# Altium schematic sheet Sheet1.SchDoc
size A0
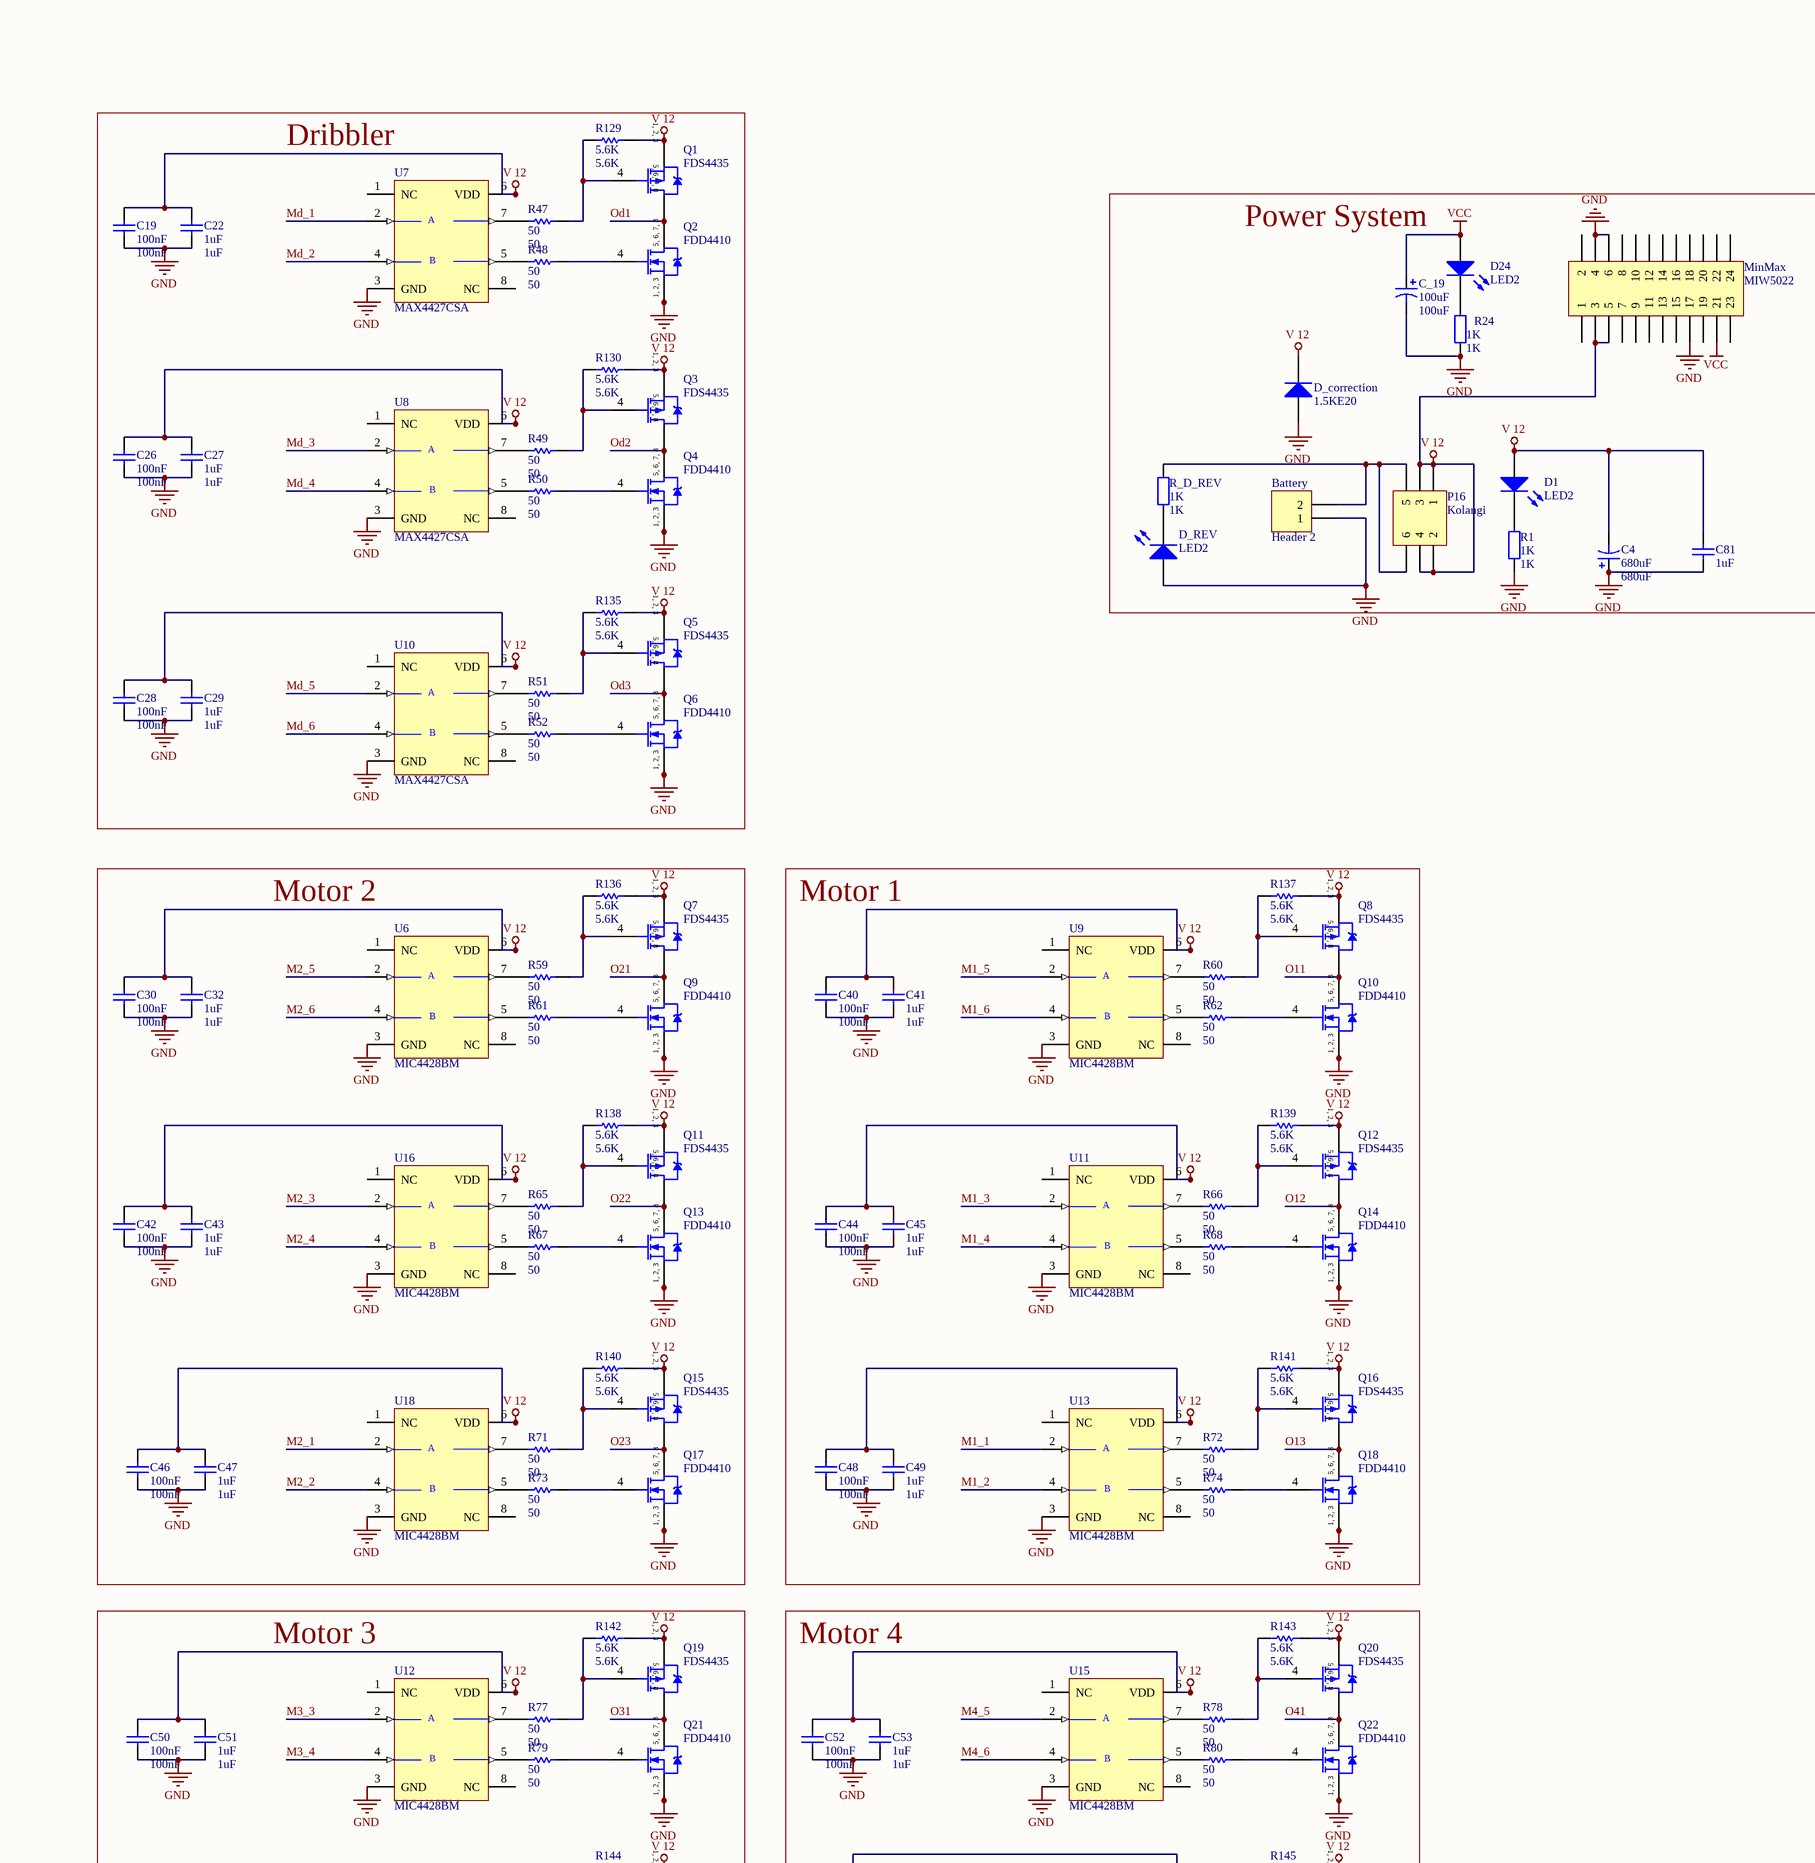
[diagram p0: Sheet1.SchDoc, top left]
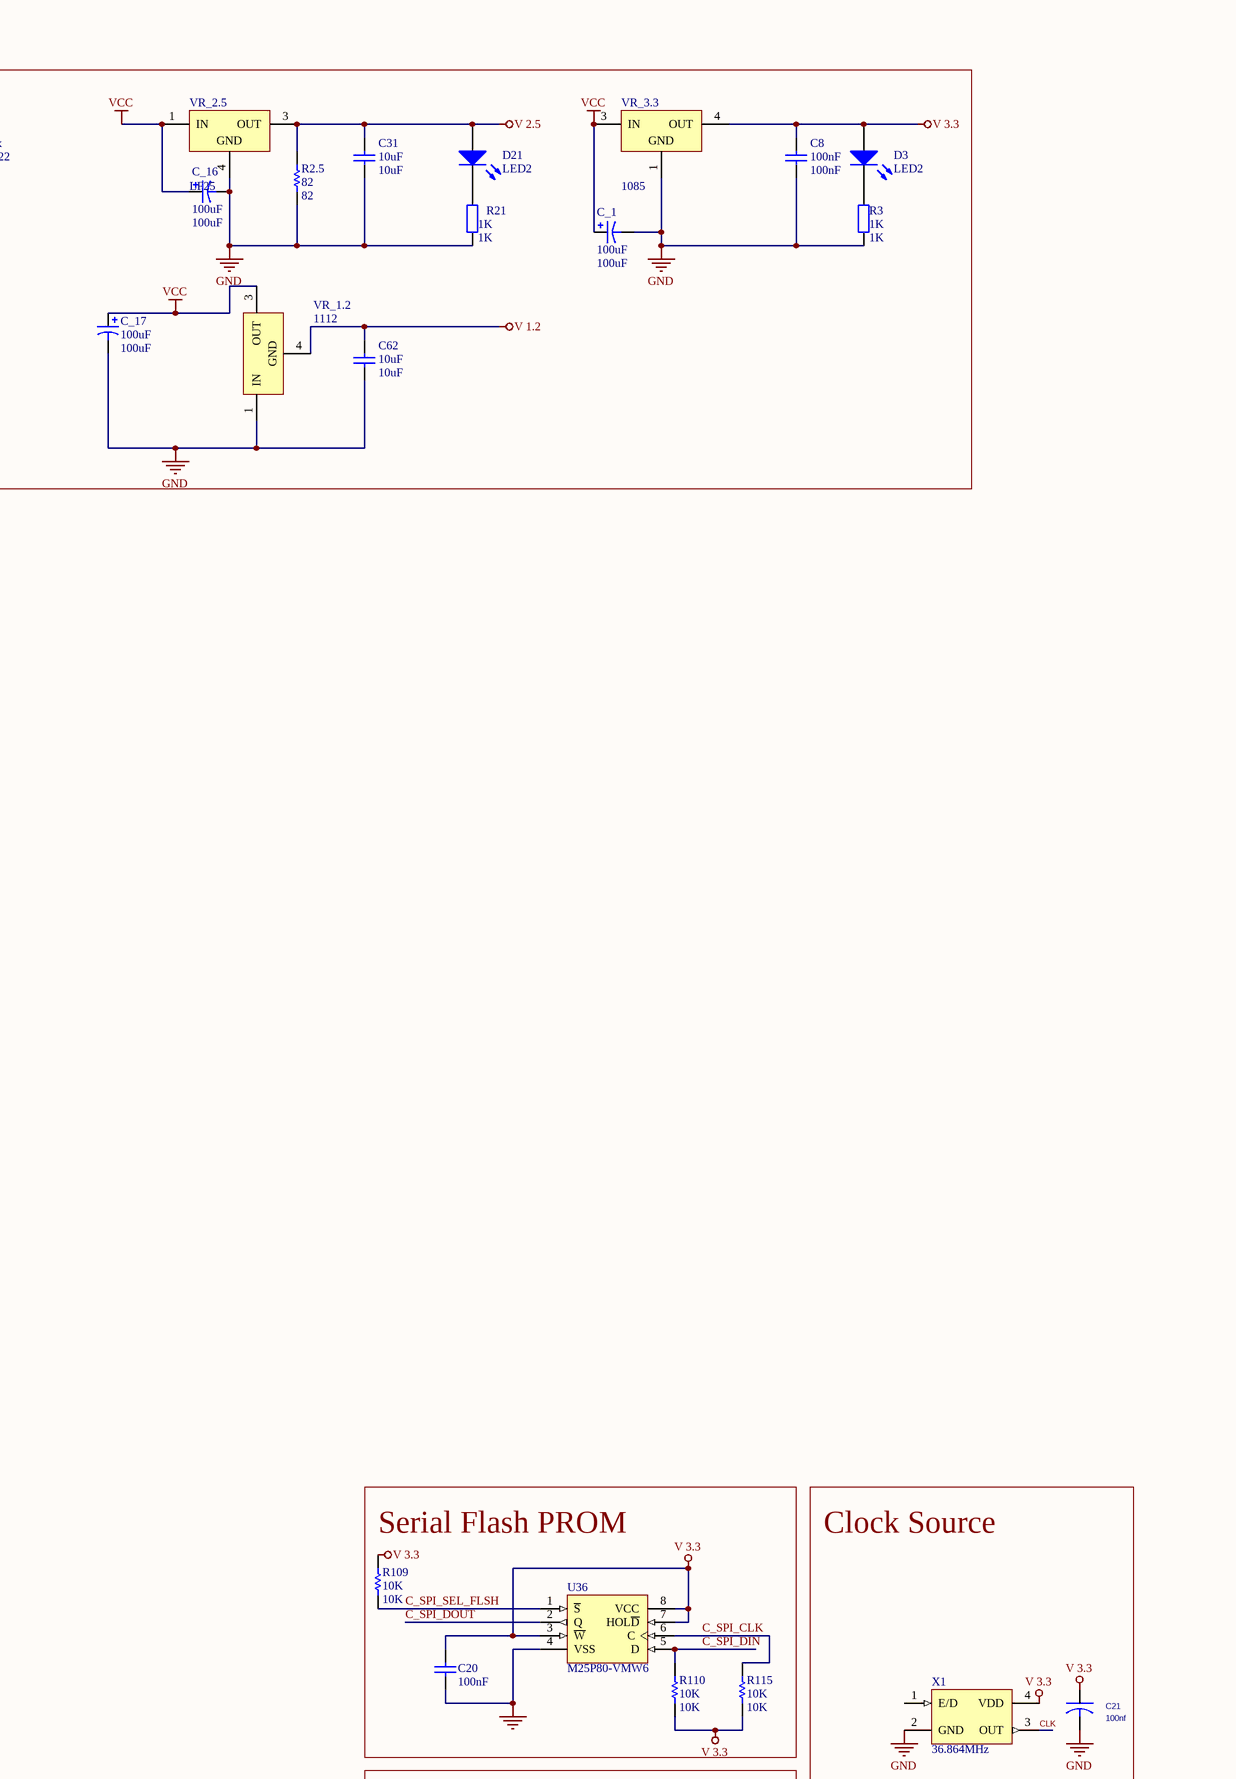
[diagram p1: Sheet1.SchDoc, top middle]
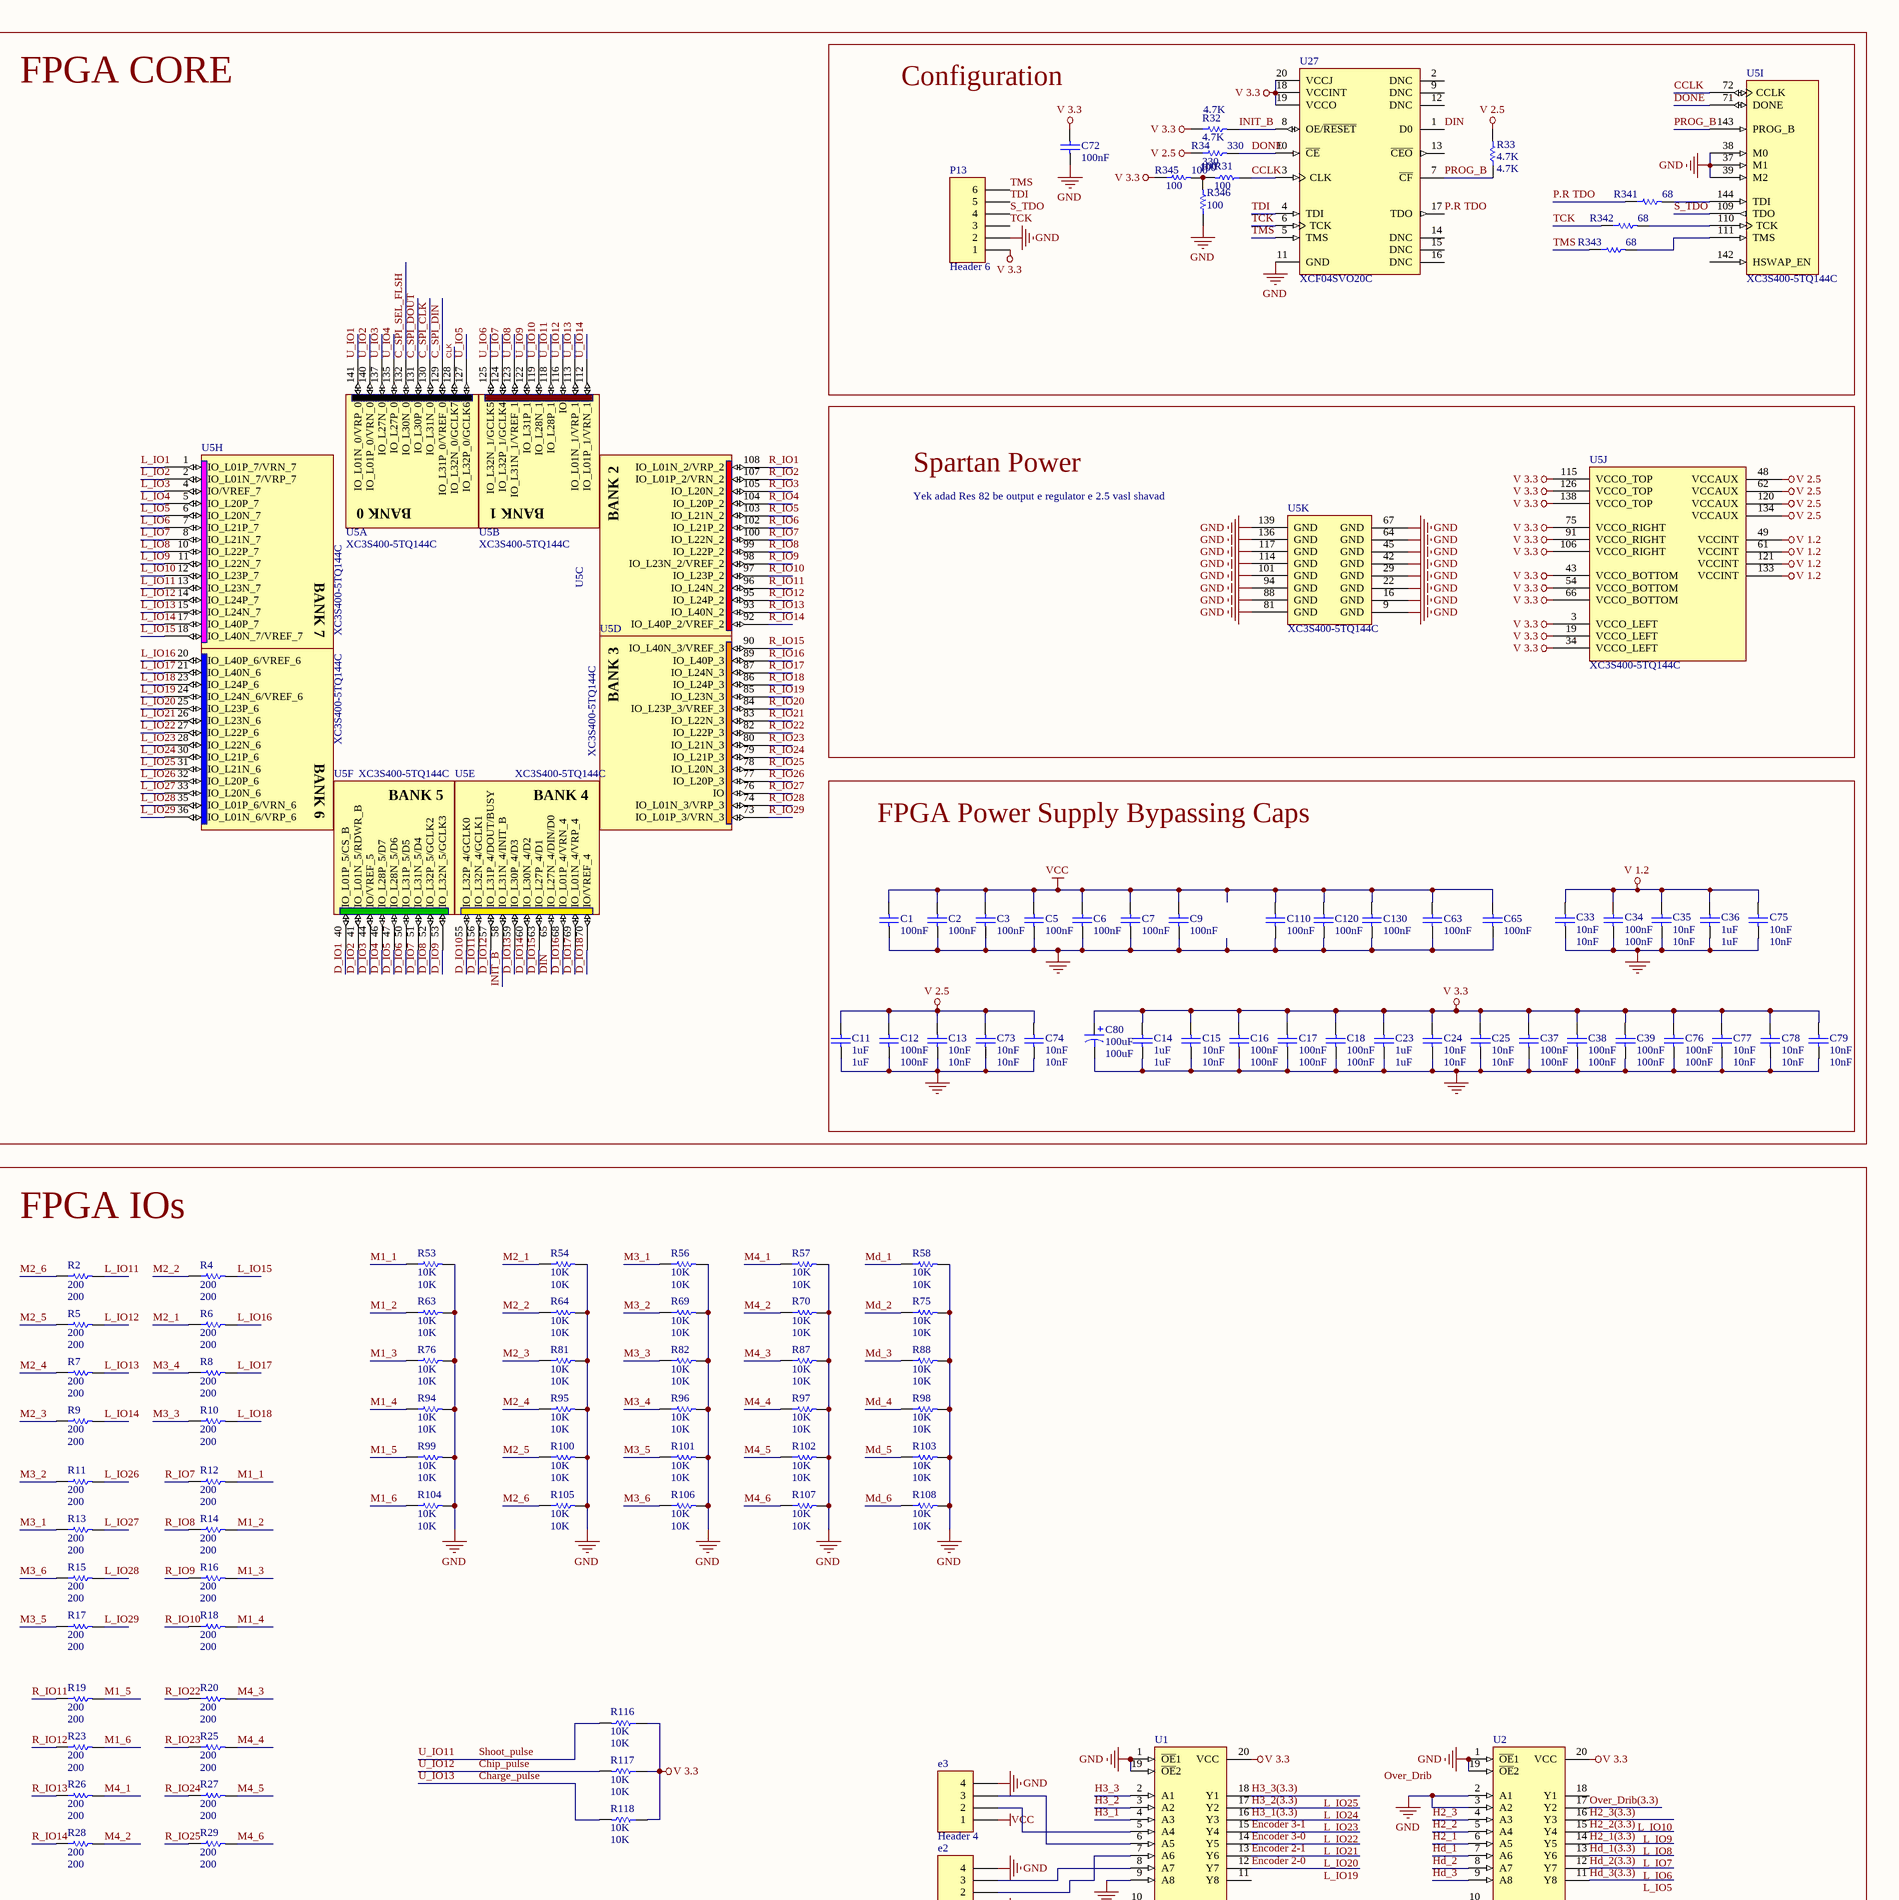
[diagram p2: Sheet1.SchDoc, top right]
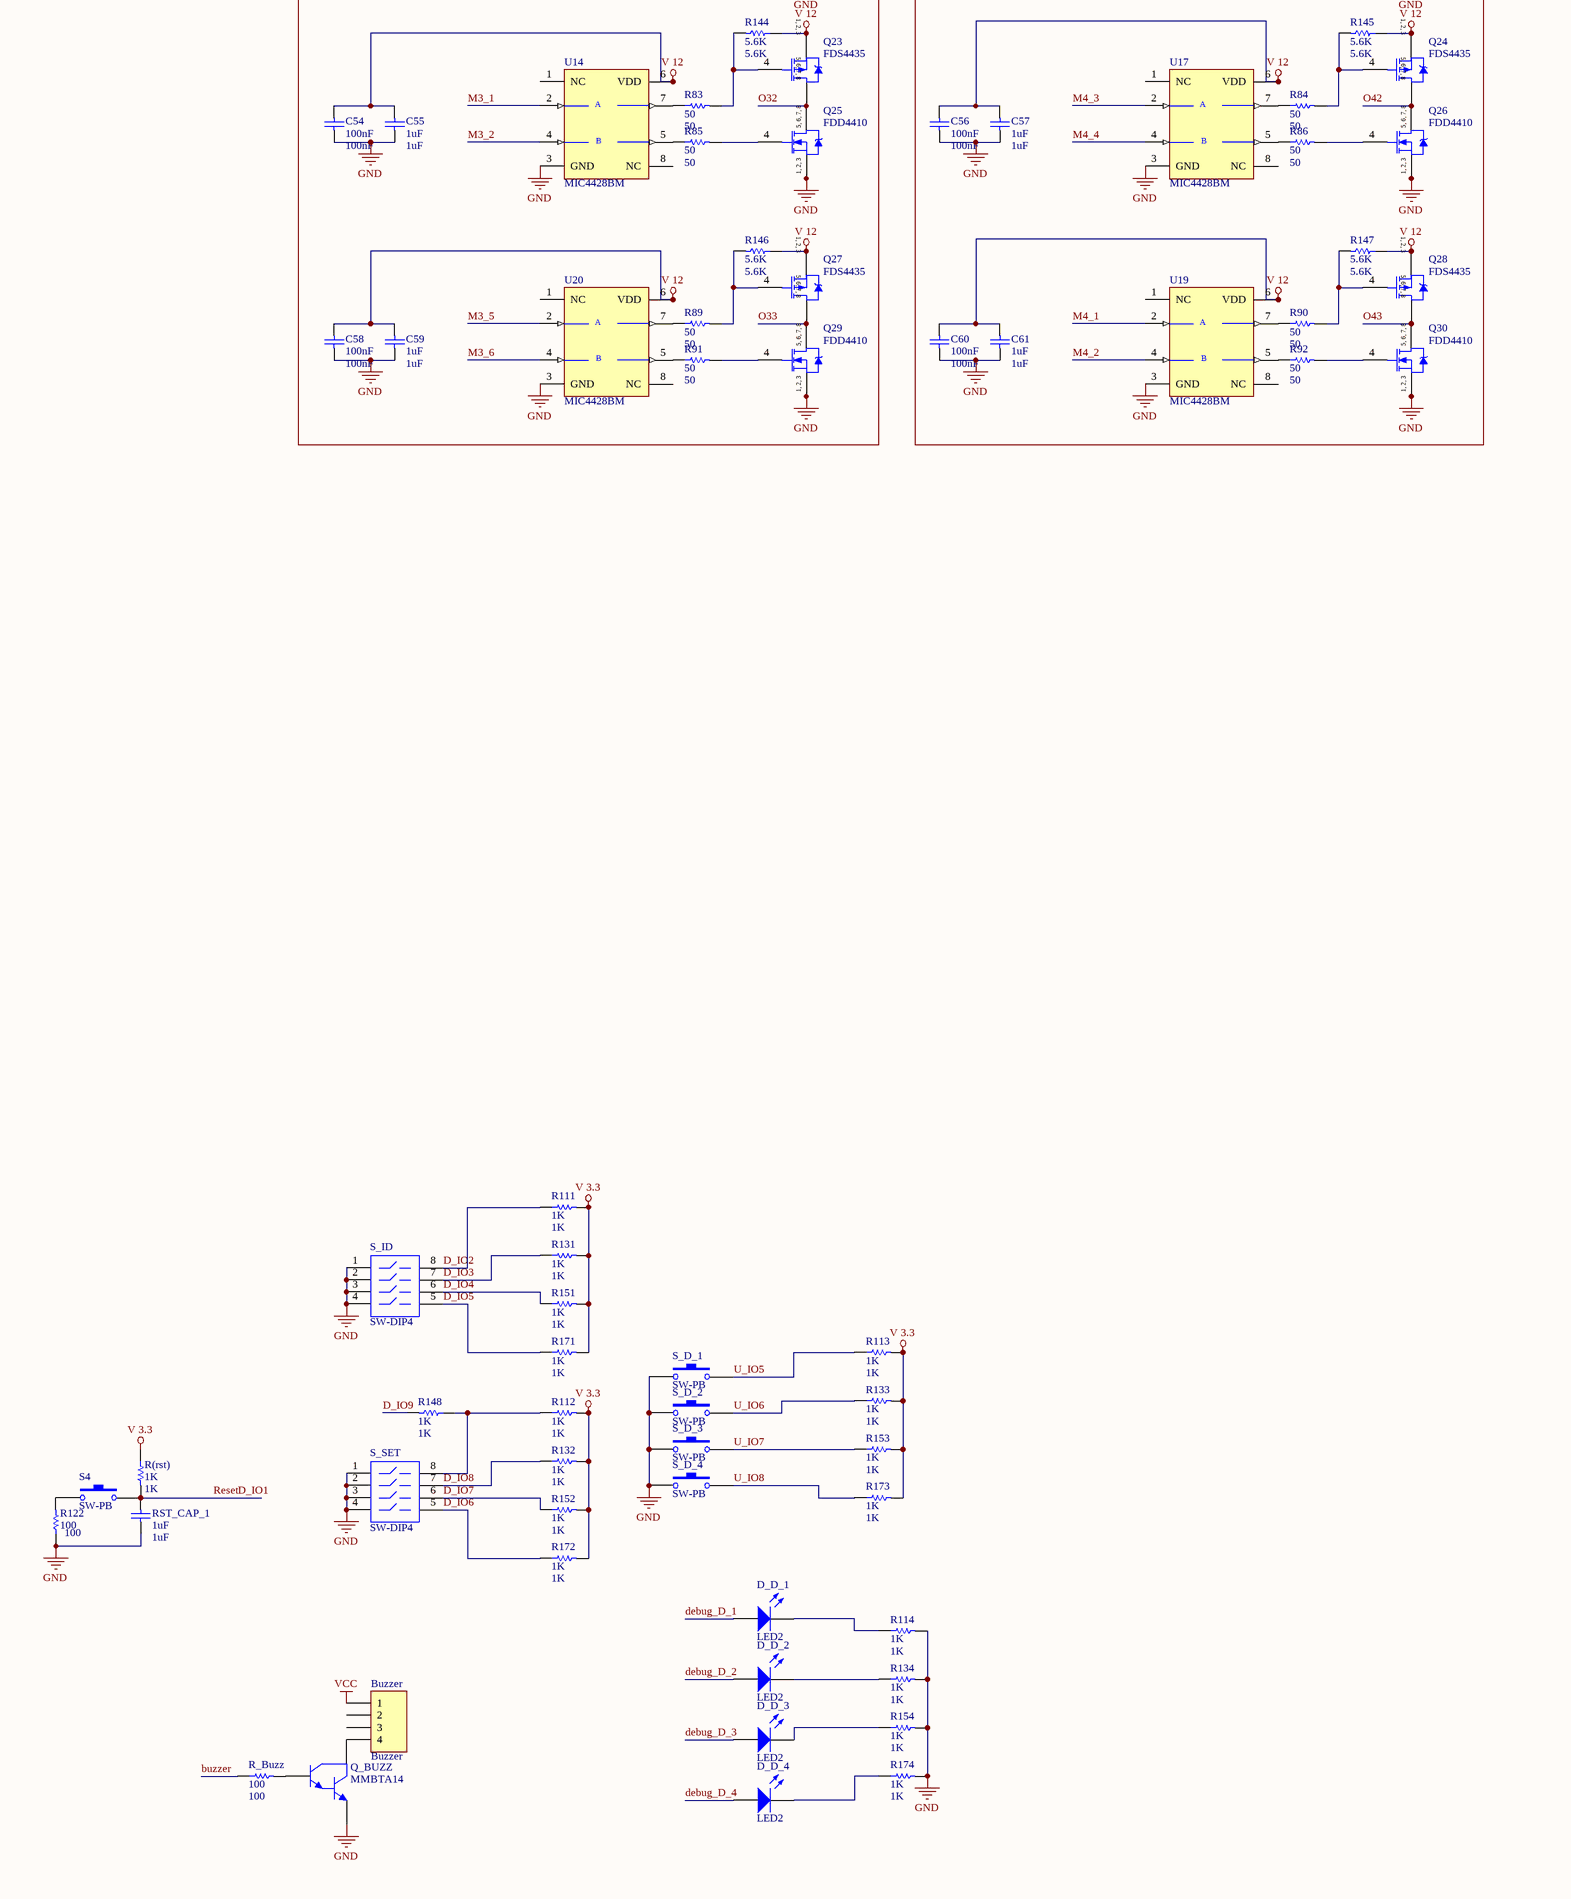
[diagram p3: Sheet1.SchDoc, bottom left]
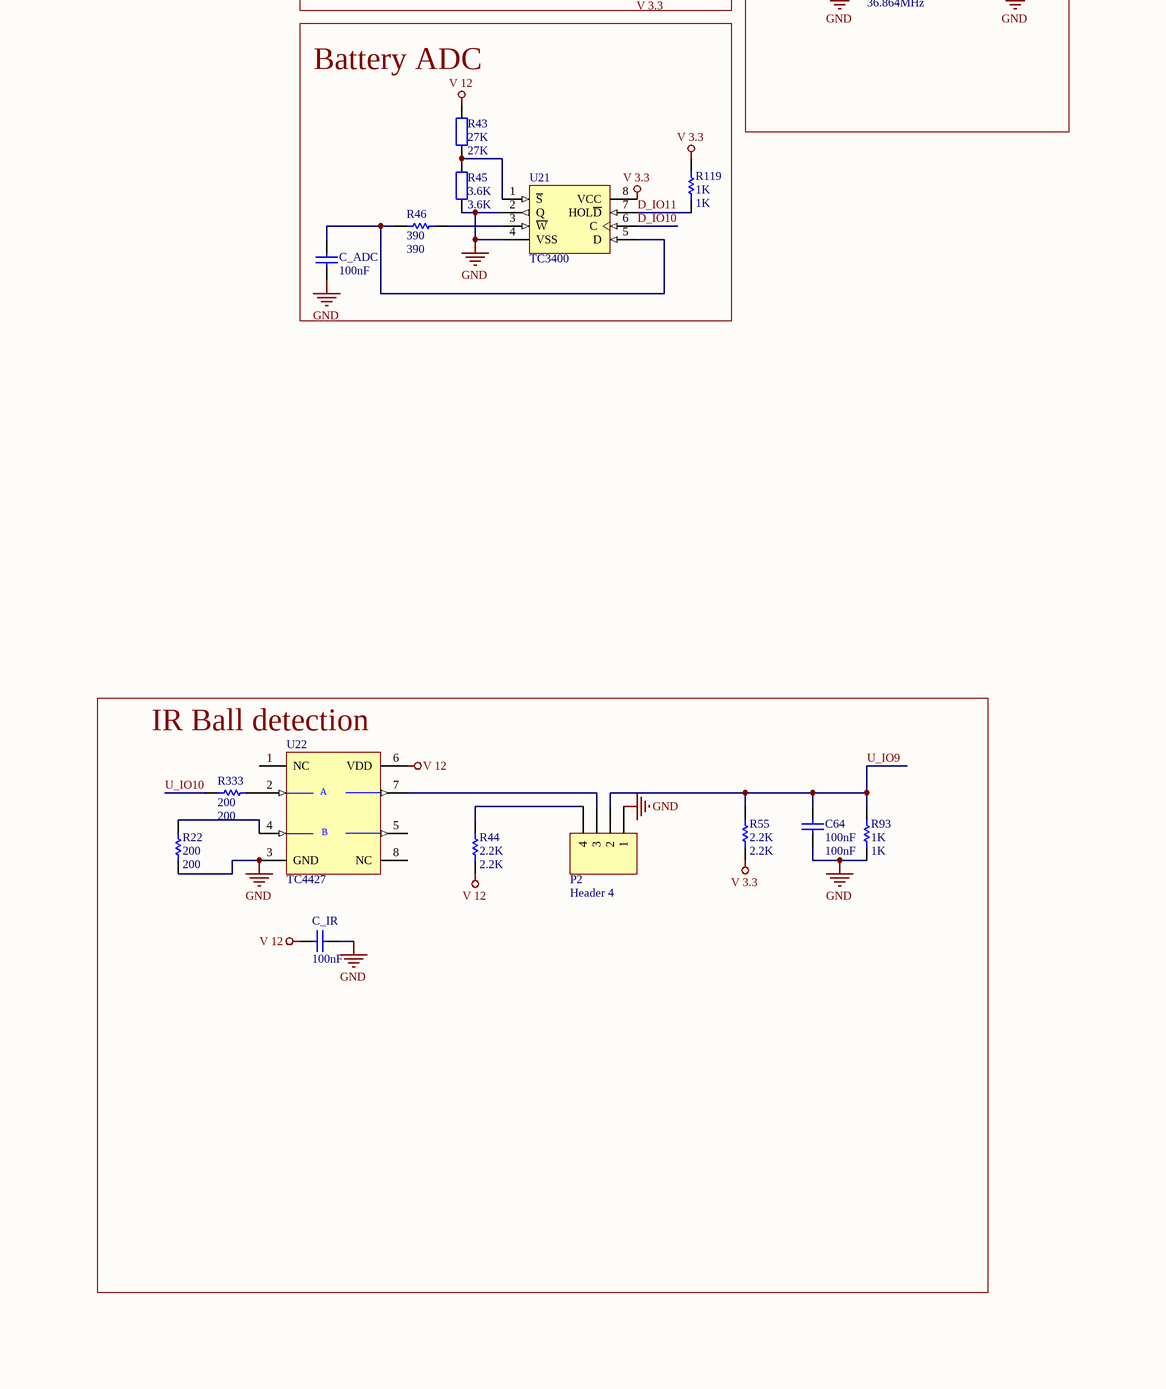
[diagram p4: Sheet1.SchDoc, bottom middle]
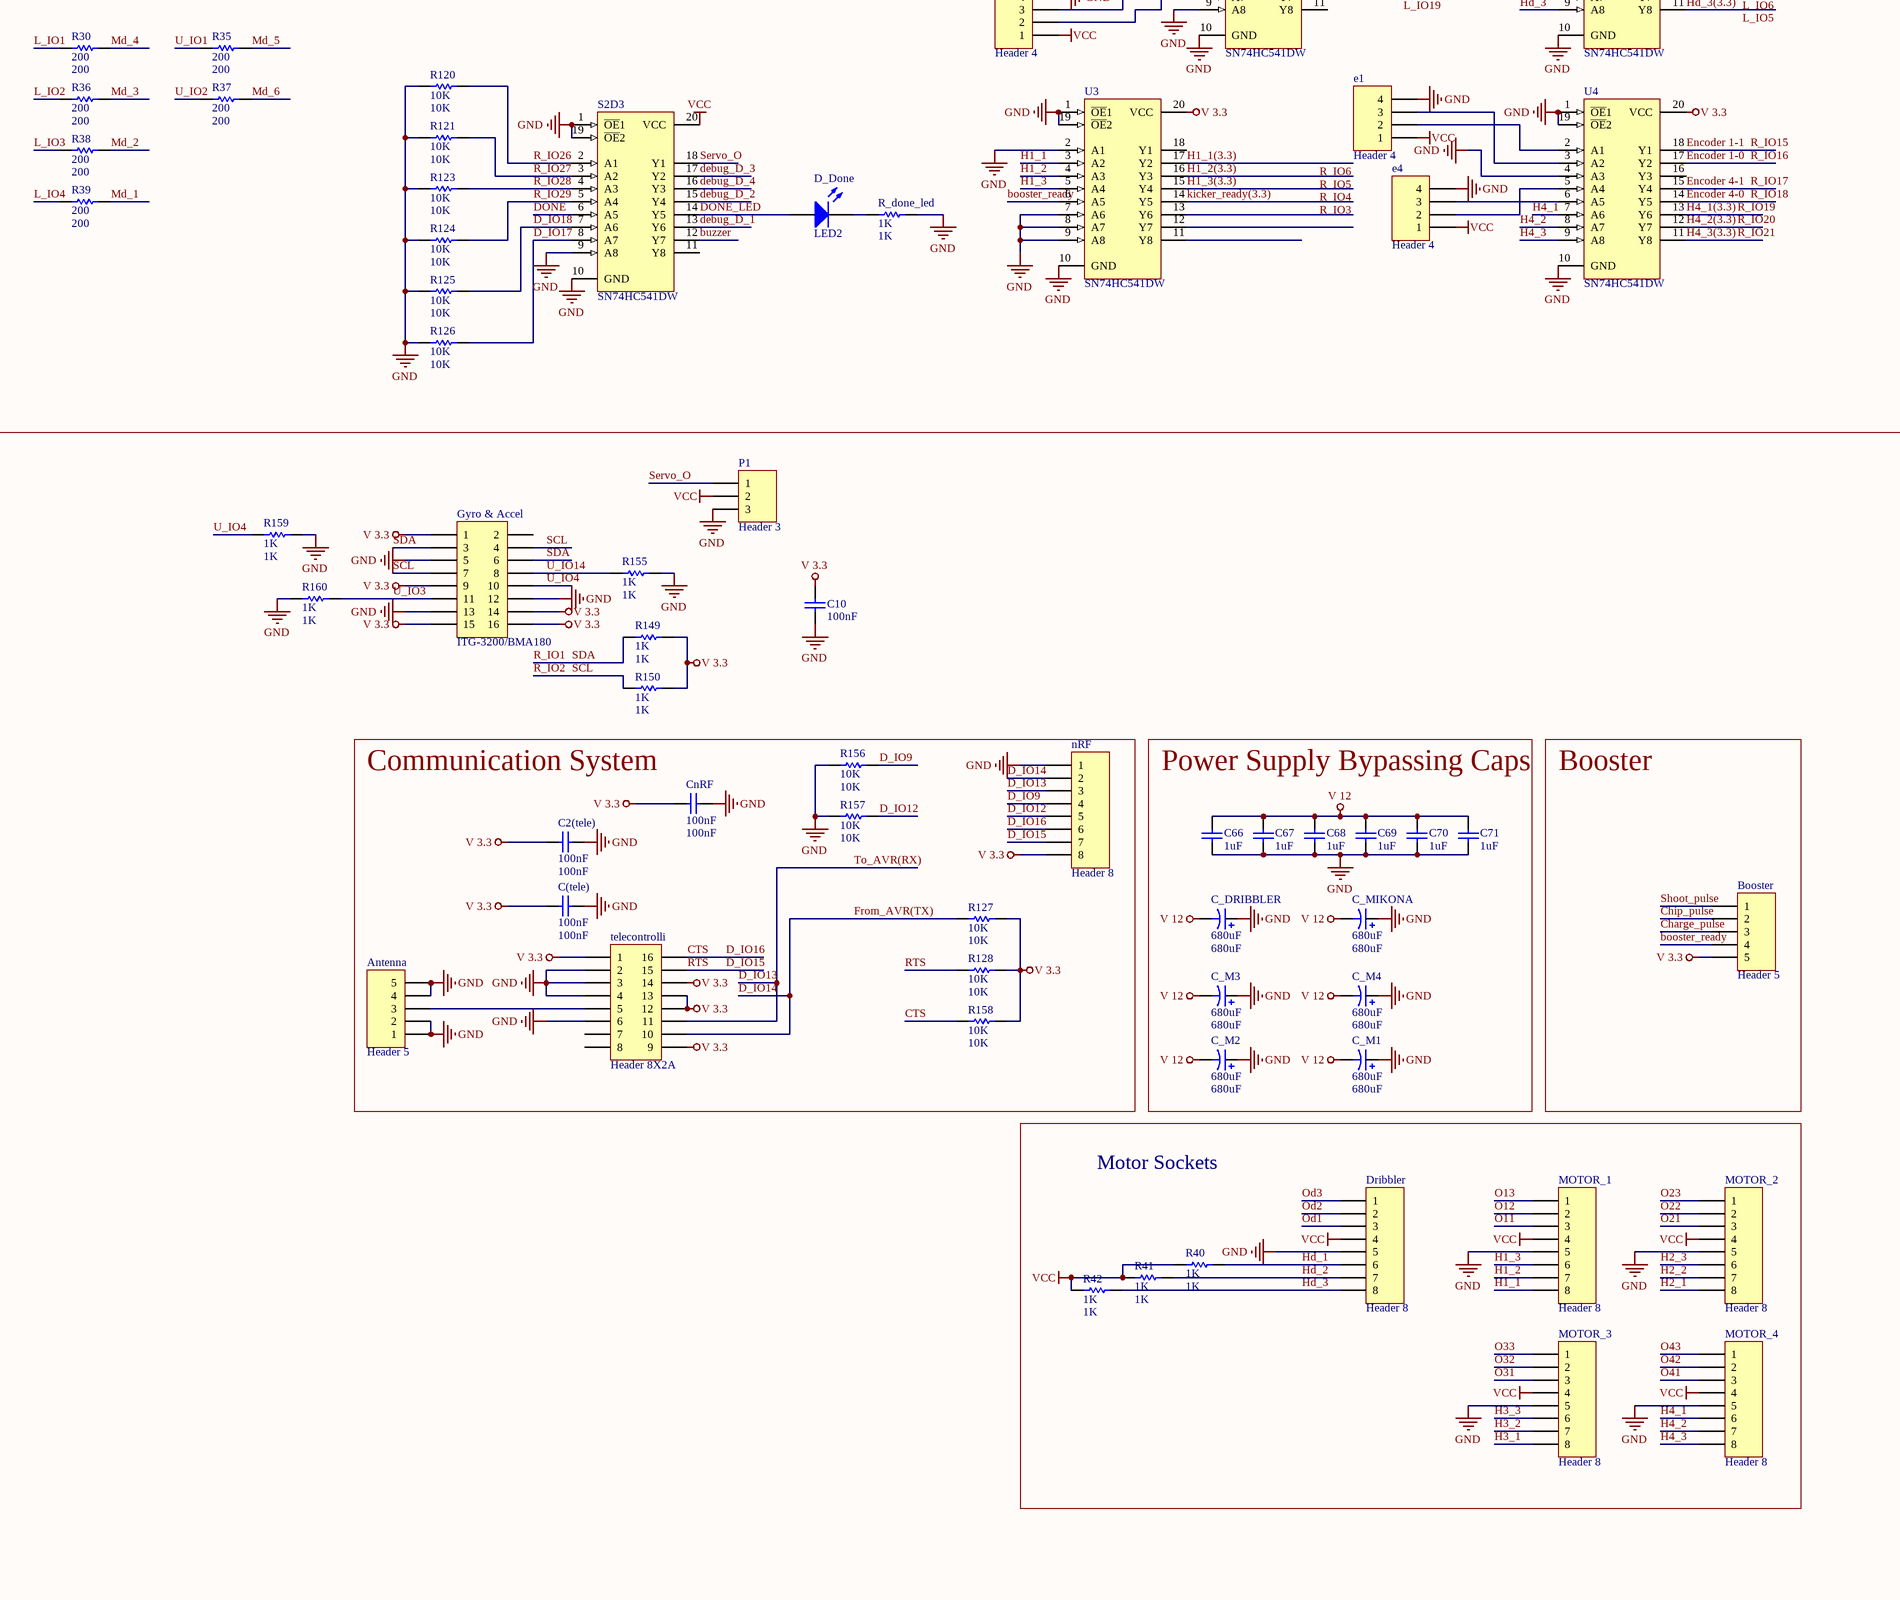
[diagram p5: Sheet1.SchDoc, bottom right]

## Parts
Antenna  Header 5  [Antenna]
Battery  Header 2  [HDR1X2]
Booster  Header 5  [HDR1X5]
Buzzer  Buzzer  [HDR1X4]
C1  100nF  [C1206]
C2  100nF  [C1206]
C2(tele)  100nF  [3216[1206]]
C3  100nF  [C1206]
C4  680uF  [CAPPR5-5x5]
C5  100nF  [C1206]
C6  100nF  [C1206]
C7  100nF  [C1206]
C8  100nF  [C1206]
C9  100nF  [C1206]
C10  100nF  [C1206]
C11  1uF  [1608[0603]]
C12  100nF  [1608[0603]]
C13  10nF  [1608[0603]]
C14  1uF  [1608[0603]]
C15  10nF  [1608[0603]]
C16  100nF  [1608[0603]]
C17  100nF  [1608[0603]]
C18  100nF  [1608[0603]]
C19  100nF  [1608[0603]]
C20  100nF  [C1206]
C21  100nf  [2012[0805]]
C22  1uF  [1608[0603]]
C23  1uF  [1608[0603]]
C24  10nF  [1608[0603]]
C25  10nF  [1608[0603]]
C26  100nF  [1608[0603]]
C27  1uF  [1608[0603]]
C28  100nF  [1608[0603]]
C29  1uF  [1608[0603]]
C30  100nF  [1608[0603]]
C31  10uF  [C1206]
C32  1uF  [1608[0603]]
C33  10nF  [1608[0603]]
C34  100nF  [1608[0603]]
C35  10nF  [1608[0603]]
C36  1uF  [1608[0603]]
C37  100nF  [1608[0603]]
C38  100nF  [1608[0603]]
C39  100nF  [1608[0603]]
C40  100nF  [1608[0603]]
C41  1uF  [1608[0603]]
C42  100nF  [1608[0603]]
C43  1uF  [1608[0603]]
C44  100nF  [1608[0603]]
C45  1uF  [1608[0603]]
C46  100nF  [1608[0603]]
C47  1uF  [1608[0603]]
C48  100nF  [1608[0603]]
C49  1uF  [1608[0603]]
C50  100nF  [1608[0603]]
C51  1uF  [1608[0603]]
C52  100nF  [1608[0603]]
C53  1uF  [1608[0603]]
C54  100nF  [1608[0603]]
C55  1uF  [1608[0603]]
C56  100nF  [1608[0603]]
C57  1uF  [1608[0603]]
C58  100nF  [1608[0603]]
C59  1uF  [1608[0603]]
C60  100nF  [1608[0603]]
C61  1uF  [1608[0603]]
C62  10uF  [C1206]
C63  100nF  [C0805]
C64  100nF  [1608[0603]]
C65  100nF  [C0805]
C66  1uF  [C0805]
C67  1uF  [C0805]
C68  1uF  [C0805]
C69  1uF  [C0805]
C70  1uF  [C0805]
C71  1uF  [C0805]
C72  100nF  [C0805]
C73  10nF  [1608[0603]]
C74  10nF  [1608[0603]]
C75  10nF  [1608[0603]]
C76  100nF  [1608[0603]]
C77  10nF  [1608[0603]]
C78  10nF  [1608[0603]]
C79  10nF  [1608[0603]]
C80  100uF  [6332[2512]]
C81  1uF  [C0805]
C110  100nF  [C1206]
C120  100nF  [C1206]
C130  100nF  [C1206]
C(tele)  100nF  [3216[1206]]
C_1  100uF  [6332[2512]]
C_16  100uF  [6332[2512]]
C_17  100uF  [6332[2512]]
C_19  100uF  [6332[2512]]
C_ADC  100nF  [C0805]
C_DRIBBLER  680uF  [CAPPR5-5x5]
C_IR  100nF  [C0805]
C_M1  680uF  [CAPPR5-5x5]
C_M2  680uF  [CAPPR5-5x5]
C_M3  680uF  [CAPPR5-5x5]
C_M4  680uF  [CAPPR5-5x5]
C_MIKONA  680uF  [CAPPR5-5x5]
CnRF  100nF  [1608[0603]]
D1  LED2  [3.2X1.6X1.1]
D3  LED2  [3.2X1.6X1.1]
D21  LED2  [3.2X1.6X1.1]
D24  LED2  [3.2X1.6X1.1]
D_correction  1.5KE20  [DO-41]
D_D_1  LED2  [3.2X1.6X1.1]
D_D_2  LED2  [3.2X1.6X1.1]
D_D_3  LED2  [3.2X1.6X1.1]
D_D_4  LED2  [3.2X1.6X1.1]
D_Done  LED2  [3.2X1.6X1.1]
D_REV  LED2  [3.2X1.6X1.1]
Dribbler  Header 8  [HDR1X8]
e1  Header 4  [HDR1X4]
e2  Header 4  [HDR1X4]
e3  Header 4  [HDR1X4]
e4  Header 4  [HDR1X4]
Gyro_&_Accel  ITG-3200/BMA180  [HDR2X8]
MinMax  MIW5022  [MIW5000]
MOTOR_1  Header 8  [HDR1X8]
MOTOR_2  Header 8  [HDR1X8]
MOTOR_3  Header 8  [HDR1X8]
MOTOR_4  Header 8  [HDR1X8]
nRF  Header 8  [HDR1X8]
P1  Header 3  [HDR1X3]
P2  Header 4  [HDR1X4]
P13  Header 6  [HDR1X6]
P16  Kolangi  [Kolang]
Q1  FDS4435  [SO-8_L]
Q2  FDD4410  [SO-8_L]
Q3  FDS4435  [SO-8_L]
Q4  FDD4410  [SO-8_L]
Q5  FDS4435  [SO-8_L]
Q6  FDD4410  [SO-8_L]
Q7  FDS4435  [SO-8_L]
Q8  FDS4435  [SO-8_L]
Q9  FDD4410  [SO-8_L]
Q10  FDD4410  [SO-8_L]
Q11  FDS4435  [SO-8_L]
Q12  FDS4435  [SO-8_L]
Q13  FDD4410  [SO-8_L]
Q14  FDD4410  [SO-8_L]
Q15  FDS4435  [SO-8_L]
Q16  FDS4435  [SO-8_L]
Q17  FDD4410  [SO-8_L]
Q18  FDD4410  [SO-8_L]
Q19  FDS4435  [SO-8_L]
Q20  FDS4435  [SO-8_L]
Q21  FDD4410  [SO-8_L]
Q22  FDD4410  [SO-8_L]
Q23  FDS4435  [SO-8_L]
Q24  FDS4435  [SO-8_L]
Q25  FDD4410  [SO-8_L]
Q26  FDD4410  [SO-8_L]
Q27  FDS4435  [SO-8_L]
Q28  FDS4435  [SO-8_L]
Q29  FDD4410  [SO-8_L]
Q30  FDD4410  [SO-8_L]
Q_BUZZ  MMBTA14  [SOT23_N]
R1  1K  [2012[0805]]
R2  200  [1608[0603]]
R2.5  82  [3216[1206]]
R3  1K  [2012[0805]]
R4  200  [1608[0603]]
R5  200  [1608[0603]]
R6  200  [1608[0603]]
R7  200  [1608[0603]]
R8  200  [1608[0603]]
R9  200  [1608[0603]]
R10  200  [1608[0603]]
R11  200  [1608[0603]]
R12  200  [1608[0603]]
R13  200  [1608[0603]]
R14  200  [1608[0603]]
R15  200  [1608[0603]]
R16  200  [1608[0603]]
R17  200  [1608[0603]]
R18  200  [1608[0603]]
R19  200  [1608[0603]]
R20  200  [1608[0603]]
R21  1K  [2012[0805]]
R22  200  [2012[0805]]
R23  200  [1608[0603]]
R24  1K  [2012[0805]]
R25  200  [1608[0603]]
R26  200  [1608[0603]]
R27  200  [1608[0603]]
R28  200  [1608[0603]]
R29  200  [1608[0603]]
R30  200  [1608[0603]]
R31  100  [2012[0805]]
R32  4.7K  [2012[0805]]
R33  4.7K  [2012[0805]]
R34  330  [2012[0805]]
R35  200  [1608[0603]]
R36  200  [1608[0603]]
R37  200  [1608[0603]]
R38  200  [1608[0603]]
R39  200  [1608[0603]]
R40  1K  [1608[0603]]
R41  1K  [1608[0603]]
R42  1K  [1608[0603]]
R43  27K  [2012[0805]]
R44  2.2K  [2012[0805]]
R45  3.6K  [2012[0805]]
R46  390  [3216[1206]]
R47  50  [1608[0603]]
R48  50  [1608[0603]]
R49  50  [1608[0603]]
R50  50  [1608[0603]]
R51  50  [1608[0603]]
R52  50  [1608[0603]]
R53  10K  [1608[0603]]
R54  10K  [1608[0603]]
R55  2.2K  [2012[0805]]
R56  10K  [1608[0603]]
R57  10K  [1608[0603]]
R58  10K  [1608[0603]]
R59  50  [1608[0603]]
R60  50  [1608[0603]]
R61  50  [1608[0603]]
R62  50  [1608[0603]]
R63  10K  [1608[0603]]
R64  10K  [1608[0603]]
R65  50  [1608[0603]]
R66  50  [1608[0603]]
R67  50  [1608[0603]]
R68  50  [1608[0603]]
R69  10K  [1608[0603]]
R70  10K  [1608[0603]]
R71  50  [1608[0603]]
R72  50  [1608[0603]]
R73  50  [1608[0603]]
R74  50  [1608[0603]]
R75  10K  [1608[0603]]
R76  10K  [1608[0603]]
R77  50  [1608[0603]]
R78  50  [1608[0603]]
R79  50  [1608[0603]]
R80  50  [1608[0603]]
R81  10K  [1608[0603]]
R82  10K  [1608[0603]]
R83  50  [1608[0603]]
R84  50  [1608[0603]]
R85  50  [1608[0603]]
R86  50  [1608[0603]]
R87  10K  [1608[0603]]
R88  10K  [1608[0603]]
R89  50  [1608[0603]]
R90  50  [1608[0603]]
R91  50  [1608[0603]]
R92  50  [1608[0603]]
R93  1K  [1608[0603]]
R94  10K  [1608[0603]]
R95  10K  [1608[0603]]
R96  10K  [1608[0603]]
R97  10K  [1608[0603]]
R98  10K  [1608[0603]]
R99  10K  [1608[0603]]
R100  10K  [1608[0603]]
R101  10K  [1608[0603]]
R102  10K  [1608[0603]]
R103  10K  [1608[0603]]
R104  10K  [1608[0603]]
R105  10K  [1608[0603]]
R106  10K  [1608[0603]]
R107  10K  [1608[0603]]
R108  10K  [1608[0603]]
R109  10K  [1608[0603]]
R110  10K  [1608[0603]]
R111  1K  [1608[0603]]
R112  1K  [1608[0603]]
R113  1K  [1608[0603]]
R114  1K  [1608[0603]]
R115  10K  [1608[0603]]
R116  10K  [1608[0603]]
R117  10K  [1608[0603]]
R118  10K  [1608[0603]]
R119  1K  [1608[0603]]
R120  10K  [1608[0603]]
R121  10K  [1608[0603]]
R122  100  [2012[0805]]
R123  10K  [1608[0603]]
R124  10K  [1608[0603]]
R125  10K  [1608[0603]]
R126  10K  [1608[0603]]
R127  10K  [1608[0603]]
R128  10K  [1608[0603]]
R129  5.6K  [1608[0603]]
R130  5.6K  [1608[0603]]
R131  1K  [1608[0603]]
R132  1K  [1608[0603]]
R133  1K  [1608[0603]]
R134  1K  [1608[0603]]
R135  5.6K  [1608[0603]]
R136  5.6K  [1608[0603]]
R137  5.6K  [1608[0603]]
R138  5.6K  [1608[0603]]
R139  5.6K  [1608[0603]]
R140  5.6K  [1608[0603]]
R141  5.6K  [1608[0603]]
R142  5.6K  [1608[0603]]
R143  5.6K  [1608[0603]]
R144  5.6K  [1608[0603]]
R145  5.6K  [1608[0603]]
R146  5.6K  [1608[0603]]
R147  5.6K  [1608[0603]]
R148  1K  [1608[0603]]
R149  1K  [1608[0603]]
R150  1K  [1608[0603]]
R151  1K  [1608[0603]]
R152  1K  [1608[0603]]
R153  1K  [1608[0603]]
R154  1K  [1608[0603]]
R155  1K  [1608[0603]]
R156  10K  [1608[0603]]
R157  10K  [1608[0603]]
R158  10K  [1608[0603]]
R159  1K  [1608[0603]]
R160  1K  [1608[0603]]
R171  1K  [1608[0603]]
R172  1K  [1608[0603]]
R173  1K  [1608[0603]]
R174  1K  [1608[0603]]
R333  200  [2012[0805]]
R341  68  [2012[0805]]
R342  68  [2012[0805]]
R343  68  [2012[0805]]
R345  100  [2012[0805]]
R346  100  [2012[0805]]
R(rst)  1K  [2012[0805]]
R_Buzz  100  [2012[0805]]
R_D_REV  1K  [2012[0805]]
R_done_led  1K  [2012[0805]]
RST_CAP_1  1uF  [3216[1206]]
S2D3  SN74HC541DW  [PW020_N]
S4  SW-PB  [SPST-2]
S_D_1  SW-PB  [SPST-2]
S_D_2  SW-PB  [SPST-2]
S_D_3  SW-PB  [SPST-2]
S_D_4  SW-PB  [SPST-2]
S_ID  SW-DIP4  [DIP-8]
S_SET  SW-DIP4  [DIP-8]
telecontrolli  Header 8X2A  [RXQ2]
U1  SN74HC541DW  [PW020_N]
U2  SN74HC541DW  [PW020_N]
U3  SN74HC541DW  [PW020_N]
U4  SN74HC541DW  [PW020_N]
U5  XC3S400-5TQ144C  [TQ144_L]  (parts A,B,C,D,E,F,G,H,I,J,K of 11)
U6  MIC4428BM  [NSO8_L]
U7  MAX4427CSA  [NSO8_L]
U8  MAX4427CSA  [NSO8_L]
U9  MIC4428BM  [NSO8_L]
U10  MAX4427CSA  [NSO8_L]
U11  MIC4428BM  [NSO8_L]
U12  MIC4428BM  [NSO8_L]
U13  MIC4428BM  [NSO8_L]
U14  MIC4428BM  [NSO8_L]
U15  MIC4428BM  [NSO8_L]
U16  MIC4428BM  [NSO8_L]
U17  MIC4428BM  [NSO8_L]
U18  MIC4428BM  [NSO8_L]
U19  MIC4428BM  [NSO8_L]
U20  MIC4428BM  [NSO8_L]
U21  TC3400  [NSO8_L]
U22  TC4427  [NSO8_L]
U27  XCF04SVO20C  [VO20_N]
U36  M25P80-VMW6  [SO8]
VR_1.2  1112  [TO-252]
VR_2.5  LF25  [TO-252]
VR_3.3  1085  [936-03]
X1  36.864MHz  [QSMO_4200]

## Blocks framed on the sheet
FPGA CORE: U5
Configuration: C72 P13 R31-R34 R341-R343 R345 R346 U5 U27
Dribbler: C19 C22 C26-C29 Q1-Q6 R47-R52 R129 R130 R135 U7 U8 U10
Power System: Battery C4 C8 C31 C62 C81 C_1 C_16 C_17 C_19 D1 D3 D21 D24 D_correction D_REV MinMax P16 R1 R2.5 R3 R21 R24 R_D_REV VR_1.2 VR_2.5 VR_3.3
Spartan Power: U5
FPGA Power Supply Bypassing Caps: C1-C3 C5-C7 C9 C11-C18 C23-C25 C33-C39 C63 C65 C73-C80 C110 C120 C130
Motor 2: C30 C32 C42 C43 C46 C47 Q7 Q9 Q11 Q13 Q15 Q17 R59 R61 R65 R67 R71 R73 R136 R138 R140 U6 U16 U18
Motor 1: C40 C41 C44 C45 C48 C49 Q8 Q10 Q12 Q14 Q16 Q18 R60 R62 R66 R68 R72 R74 R137 R139 R141 U9 U11 U13
FPGA IOs: D_Done e1-e4 R2 R4-R20 R23 R25-R30 R35-R39 R53 R54 R56-R58 R63 R64 R69 R70 R75 R76 R81 R82 R87 R88 R94-R108 R116-R118 R120 R121 R123-R126 R_done_led S2D3 U1-U4
Motor 3: C50 C51 C54 C55 C58 C59 Q19 Q21 Q23 Q25 Q27 Q29 R77 R79 R83 R85 R89 R91 R142 R144 R146 U12 U14 U20
Motor 4: C52 C53 C56 C57 C60 C61 Q20 Q22 Q24 Q26 Q28 Q30 R78 R80 R84 R86 R90 R92 R143 R145 R147 U15 U17 U19
Serial Flash PROM: C20 R109 R110 R115 U36
Clock Source: C21 X1
Battery ADC: C_ADC R43 R45 R46 R119 U21
IR Ball detection: C64 C_IR P2 R22 R44 R55 R93 R333 U22
Communication System: Antenna C2(tele) C(tele) CnRF nRF R127 R128 R156-R158 telecontrolli
Power Supply Bypassing Caps: C66-C71 C_DRIBBLER C_M1-C_M4 C_MIKONA
Booster: Booster
Motor Sockets: Dribbler MOTOR_1-MOTOR_4 R40-R42

## Nets
GND: Antenna.1 Antenna.2 Antenna.4 Antenna.5 Battery.1 C1.2 C2.2 C2(tele).2 C3.2 C4.1 C5.2 C6.2 C7.2 C8.2 C9.2 C10.2 C11.1 C12.1 C13.1 C14.1 C15.1 C16.1 C17.1 C18.1 C19.1 C20.2 C21.2 C22.1 C23.1 C24.1 C25.1 C26.1 C27.1 C28.1 C29.1 C30.1 C31.1 C32.1 C33.1 C34.1 C35.1 C36.1 C37.1 C38.1 C39.1 C40.1 C41.1 C42.1 C43.1 C44.1 C45.1 C46.1 C47.1 C48.1 C49.1 C50.1 C51.1 C52.1 C53.1 C54.1 C55.1 C56.1 C57.1 C58.1 C59.1 C60.1 C61.1 C62.1 C63.2 C64.1 C65.2 C66.2 C67.2 C68.2 C69.2 C70.2 C71.2 C72.2 C73.1 C74.1 C75.1 C76.1 C77.1 C78.1 C79.1 C80.2 C81.2 C110.2 C120.2 C130.2 C(tele).2 C_1.2 C_16.2 C_17.2 C_19.2 C_ADC.1 C_DRIBBLER.1 C_IR.2 C_M1.1 C_M2.1 C_M3.1 C_M4.1 C_MIKONA.1 CnRF.1 D_correction.1(A) D_REV.1(A) Dribbler.5 e1.4 e2.4 e3.4 e4.4 Gyro_&_Accel.5 Gyro_&_Accel.12 Gyro_&_Accel.13 MinMax.4 MinMax.6 MinMax.17 MOTOR_1.5 MOTOR_2.5 MOTOR_3.5 MOTOR_4.5 nRF.1 P1.3 P2.1 P13.2 Q2.1(S) Q2.2(S) Q2.3(S) Q4.1(S) Q4.2(S) Q4.3(S) Q6.1(S) Q6.2(S) Q6.3(S) Q9.1(S) Q9.2(S) Q9.3(S) Q10.1(S) Q10.2(S) Q10.3(S) Q13.1(S) Q13.2(S) Q13.3(S) Q14.1(S) Q14.2(S) Q14.3(S) Q17.1(S) Q17.2(S) Q17.3(S) Q18.1(S) Q18.2(S) Q18.3(S) Q21.1(S) Q21.2(S) Q21.3(S) Q22.1(S) Q22.2(S) Q22.3(S) Q25.1(S) Q25.2(S) Q25.3(S) Q26.1(S) Q26.2(S) Q26.3(S) Q29.1(S) Q29.2(S) Q29.3(S) Q30.1(S) Q30.2(S) Q30.3(S) Q_BUZZ.2(E) R1.2 R2.5.1 R3.1 R21.1 R22.2 R24.1 R45.1 R53.2 R54.2 R56.2 R57.2 R58.2 R63.2 R64.2 R69.2 R70.2 R75.2 R76.2 R81.2 R82.2 R87.2 R88.2 R93.1 R94.2 R95.2 R96.2 R97.2 R98.2 R99.2 R100.2 R101.2 R102.2 R103.2 R104.2 R105.2 R106.2 R107.2 R108.2 R114.2 R120.2 R121.2 R122.1 R123.2 R124.2 R125.2 R126.2 R134.2 R154.2 R155.2 R156.2 R157.2 R159.2 R160.1 R174.2 R346.1 R_done_led.2 RST_CAP_1.1 S2D3.1(~{OE}1) S2D3.9(A8) S2D3.10(GND) S2D3.19(~{OE}2) S_D_1.1 S_D_2.1 S_D_3.1 S_D_4.1 S_ID.1 S_ID.2 S_ID.3 S_ID.4 S_SET.1 S_SET.2 S_SET.3 S_SET.4 telecontrolli.2 telecontrolli.3 telecontrolli.4 telecontrolli.6 U1.1(~{OE}1) U1.9(A8) U1.10(GND) U1.19(~{OE}2) U2.1(~{OE}1) U2.2(A1) U2.3(A2) U2.10(GND) U2.19(~{OE}2) U3.1(~{OE}1) U3.2(A1) U3.7(A6) U3.8(A7) U3.9(A8) U3.10(GND) U3.19(~{OE}2) U4.1(~{OE}1) U4.4(A3) U4.10(GND) U4.19(~{OE}2) U5.9(GND) U5.16(GND) U5.22(GND) U5.29(GND) U5.37(M1) U5.38(M0) U5.39(M2) U5.42(GND) U5.45(GND) U5.64(GND) U5.67(GND) U5.81(GND) U5.88(GND) U5.94(GND) U5.101(GND) U5.114(GND) U5.117(GND) U5.136(GND) U5.139(GND) U6.3(GND) U7.3(GND) U8.3(GND) U9.3(GND) U10.3(GND) U11.3(GND) U12.3(GND) U13.3(GND) U14.3(GND) U15.3(GND) U16.3(GND) U17.3(GND) U18.3(GND) U19.3(GND) U20.3(GND) U21.2(Q) U21.4(VSS) U22.3(GND) U27.11(GND) U36.4(VSS) VR_1.2.1(IN) VR_2.5.4(GND) VR_3.3.1(GND) X1.2(GND)
V 1.2: C33.2 C34.2 C35.2 C36.2 C62.2 C75.2 U5.49(VCCINT) U5.61(VCCINT) U5.121(VCCINT) U5.133(VCCINT) VR_1.2.4(GND)
V 2.5: C11.2 C12.2 C13.2 C31.2 C73.2 C74.2 D21.1(A) R2.5.2 R33.2 R34.1 U5.48(VCCAUX) U5.62(VCCAUX) U5.120(VCCAUX) U5.134(VCCAUX) VR_2.5.3(OUT)
V 3.3: Booster.5 C2(tele).1 C8.1 C10.1 C14.2 C15.2 C16.2 C17.2 C18.2 C20.1 C21.1 C23.2 C24.2 C25.2 C37.2 C38.2 C39.2 C72.1 C76.2 C77.2 C78.2 C79.2 C80.1 C(tele).1 CnRF.2 D3.1(A) Gyro_&_Accel.1 Gyro_&_Accel.9 Gyro_&_Accel.14 Gyro_&_Accel.15 Gyro_&_Accel.16 nRF.8 P13.1 R32.1 R55.2 R109.1 R110.1 R111.2 R112.2 R113.2 R115.2 R116.1 R117.1 R118.1 R119.1 R127.1 R128.1 R131.2 R132.2 R133.2 R149.1 R150.1 R151.2 R152.2 R153.2 R158.1 R171.2 R172.2 R173.2 R345.1 R(rst).1 telecontrolli.1 telecontrolli.11(14) telecontrolli.12(13) telecontrolli.13(12) telecontrolli.16(9) U1.20(VCC) U2.20(VCC) U3.20(VCC) U4.20(VCC) U5.3(VCCO_LEFT) U5.19(VCCO_LEFT) U5.34(VCCO_LEFT) U5.43(VCCO_BOTTOM) U5.54(VCCO_BOTTOM) U5.66(VCCO_BOTTOM) U5.75(VCCO_RIGHT) U5.91(VCCO_RIGHT) U5.106(VCCO_RIGHT) U5.115(VCCO_TOP) U5.126(VCCO_TOP) U5.138(VCCO_TOP) U21.8(VCC) U27.18(VCCINT) U27.19(VCCO) U27.20(VCCJ) U36.3(~{W}) U36.7(HOL~{D}) U36.8(VCC) VR_3.3.4(OUT) X1.4(VDD)
V 12: C4.2 C19.2 C22.2 C26.2 C27.2 C28.2 C29.2 C30.2 C32.2 C40.2 C41.2 C42.2 C43.2 C44.2 C45.2 C46.2 C47.2 C48.2 C49.2 C50.2 C51.2 C52.2 C53.2 C54.2 C55.2 C56.2 C57.2 C58.2 C59.2 C60.2 C61.2 C66.1 C67.1 C68.1 C69.1 C70.1 C71.1 C81.1 C_DRIBBLER.2 C_IR.1 C_M1.2 C_M2.2 C_M3.2 C_M4.2 C_MIKONA.2 D1.1(A) D_correction.2(K) MinMax.3 MinMax.5 P16.1 P16.2 P16.3 P16.4 Q1.1(S) Q1.2(S) Q1.3(S) Q3.1(S) Q3.2(S) Q3.3(S) Q5.1(S) Q5.2(S) Q5.3(S) Q7.1(S) Q7.2(S) Q7.3(S) Q8.1(S) Q8.2(S) Q8.3(S) Q11.1(S) Q11.2(S) Q11.3(S) Q12.1(S) Q12.2(S) Q12.3(S) Q15.1(S) Q15.2(S) Q15.3(S) Q16.1(S) Q16.2(S) Q16.3(S) Q19.1(S) Q19.2(S) Q19.3(S) Q20.1(S) Q20.2(S) Q20.3(S) Q23.1(S) Q23.2(S) Q23.3(S) Q24.1(S) Q24.2(S) Q24.3(S) Q27.1(S) Q27.2(S) Q27.3(S) Q28.1(S) Q28.2(S) Q28.3(S) R43.2 R44.2 R129.1 R130.1 R135.1 R136.1 R137.1 R138.1 R139.1 R140.1 R141.1 R142.1 R143.1 R144.1 R145.1 R146.1 R147.1 U6.6(VDD) U7.6(VDD) U8.6(VDD) U9.6(VDD) U10.6(VDD) U11.6(VDD) U12.6(VDD) U13.6(VDD) U14.6(VDD) U15.6(VDD) U16.6(VDD) U17.6(VDD) U18.6(VDD) U19.6(VDD) U20.6(VDD) U22.6(VDD)
VCC: Buzzer.1 C1.1 C2.1 C3.1 C5.1 C6.1 C7.1 C9.1 C63.1 C65.1 C110.1 C120.1 C130.1 C_1.1 C_16.1 C_17.1 C_19.1 D24.1(A) Dribbler.4 e1.1 e2.1 e3.1 e4.1 MinMax.21 MOTOR_1.4 MOTOR_2.4 MOTOR_3.4 MOTOR_4.4 P1.2 R40.1 R41.1 R42.1 S2D3.20(VCC) VR_1.2.3(OUT) VR_2.5.1(IN) VR_3.3.3(IN)
booster_ready: Booster.4 U3.6(A5)
buzzer: R_Buzz.1 S2D3.12(Y7)
C_SPI_CLK: R115.1 U5.130(IO_L31N_0) U36.6(C)
C_SPI_DIN: R110.2 U5.129(IO_L31P_0/VREF_0) U36.5(D)
C_SPI_DOUT: U5.131(IO_L30P_0) U36.2(Q)
C_SPI_SEL_FLSH: R109.2 U5.132(IO_L30N_0) U36.1(~{S})
CCLK: R31.1 U5.72(CCLK) U27.3(CLK)
Charge_pulse: Booster.3 R118.2 U5.113(IO_L01N_1/VRP_1)  [also labelled U_IO13]
Chip_pulse: Booster.2 R117.2 U5.116(IO)  [also labelled U_IO12]
CLK: U5.128(IO_L32N_0/GCLK7) X1.3(OUT)
CTS: nRF.6 R158.2 telecontrolli.9(16) U5.68(IO_L01P_4/VRN_4)  [also labelled D_IO16]
D_IO1: R(rst).2 RST_CAP_1.2 S4.2 U5.40(IO_L01P_5/CS_B)  [also labelled Reset]
D_IO2: R111.1 S_ID.8 U5.41(IO_L01N_5/RDWR_B)
D_IO3: R131.1 S_ID.7 U5.44(IO/VREF_5)
D_IO4: R151.1 S_ID.6 U5.46(IO_L28P_5/D7)
D_IO5: R171.1 S_ID.5 U5.47(IO_L28N_5/D6)
D_IO6: R172.1 S_SET.5 U5.50(IO_L31P_5/D5)
D_IO7: R152.1 S_SET.6 U5.51(IO_L31N_5/D4)
D_IO8: R132.1 S_SET.7 U5.52(IO_L32P_5/GCLK2)
D_IO9: nRF.4 R148.2 R156.1 U5.53(IO_L32N_5/GCLK3)
D_IO10: U5.55(IO_L32P_4/GCLK0) U21.6(C)
D_IO11: R119.2 U5.56(IO_L32N_4/GCLK1) U21.7(HOL~{D})
D_IO12: nRF.5 R157.1 U5.57(IO_L31P_4/DOUT/BUSY)
D_IO13: nRF.3 telecontrolli.14(11) U5.59(IO_L30P_4/D3)  [also labelled To_AVR(RX)]
D_IO14: nRF.2 R127.2 telecontrolli.15(10) U5.60(IO_L30N_4/D2)  [also labelled From_AVR(TX)]
D_IO15: nRF.7 R128.2 telecontrolli.10(15) U5.63(IO_L27P_4/D1)  [also labelled RTS]
D_IO17: R126.1 S2D3.8(A7) U5.69(IO_L01N_4/VRP_4)
D_IO18: R125.1 S2D3.7(A6) U5.70(IO/VREF_4)
debug_D_1: D_D_1.1(A) S2D3.13(Y6)
debug_D_2: D_D_2.1(A) S2D3.15(Y4)
debug_D_3: D_D_3.1(A) S2D3.17(Y2)
debug_D_4: D_D_4.1(A) S2D3.16(Y3)
DIN: U5.65(IO_L27N_4/DIN/D0) U27.1(D0)
DONE: R34.2 S2D3.6(A5) U5.71(DONE) U27.10(~{CE})
DONE_LED: D_Done.1(A) S2D3.14(Y5)
Encoder 1-0: U4.17(Y2) U5.89(IO_L40P_3)  [also labelled R_IO16]
Encoder 1-1: U4.18(Y1) U5.90(IO_L40N_3/VREF_3)  [also labelled R_IO15]
Encoder 2-0: U1.12(Y7) U5.24(IO_L24N_6/VREF_6)  [also labelled L_IO19]
Encoder 2-1: U1.13(Y6) U5.25(IO_L23P_6)  [also labelled L_IO20]
Encoder 3-0: U1.14(Y5) U5.26(IO_L23N_6)  [also labelled L_IO21]
Encoder 3-1: U1.15(Y4) U5.27(IO_L22P_6)  [also labelled L_IO22]
Encoder 4-0: U4.14(Y5) U5.86(IO_L24P_3)  [also labelled R_IO18]
Encoder 4-1: U4.15(Y4) U5.87(IO_L24N_3)  [also labelled R_IO17]
H1_1: MOTOR_1.8 U3.3(A2)
H1_1(3.3): U3.17(Y2) U5.102(IO_L21P_2)  [also labelled R_IO6]
H1_2: MOTOR_1.7 U3.4(A3)
H1_2(3.3): U3.16(Y3) U5.103(IO_L21N_2)  [also labelled R_IO5]
H1_3: MOTOR_1.6 U3.5(A4)
H1_3(3.3): U3.15(Y4) U5.104(IO_L20P_2)  [also labelled R_IO4]
H2_1: MOTOR_2.8 U2.6(A5)
H2_1(3.3): U2.14(Y5) U5.10(IO_L22P_7)  [also labelled L_IO8]
H2_2: MOTOR_2.7 U2.5(A4)
H2_2(3.3): U2.15(Y4) U5.11(IO_L22N_7)  [also labelled L_IO9]
H2_3: MOTOR_2.6 U2.4(A3)
H2_3(3.3): U2.16(Y3) U5.12(IO_L23P_7)  [also labelled L_IO10]
H3_1: MOTOR_3.8 U1.4(A3)
H3_1(3.3): U1.16(Y3) U5.28(IO_L22N_6)  [also labelled L_IO23]
H3_2: MOTOR_3.7 U1.3(A2)
H3_2(3.3): U1.17(Y2) U5.30(IO_L21P_6)  [also labelled L_IO24]
H3_3: MOTOR_3.6 U1.2(A1)
H3_3(3.3): U1.18(Y1) U5.31(IO_L21N_6)  [also labelled L_IO25]
H4_1: MOTOR_4.6 U4.7(A6)
H4_1(3.3): U4.13(Y6) U5.85(IO_L23N_3)  [also labelled R_IO19]
H4_2: MOTOR_4.7 U4.8(A7)
H4_2(3.3): U4.12(Y7) U5.84(IO_L23P_3/VREF_3)  [also labelled R_IO20]
H4_3: MOTOR_4.8 U4.9(A8)
H4_3(3.3): U4.11(Y8) U5.83(IO_L22N_3)  [also labelled R_IO21]
Hd_1: Dribbler.6 R40.2 U2.7(A6)
Hd_1(3.3): U2.13(Y6) U5.8(IO_L21N_7)  [also labelled L_IO7]
Hd_2: Dribbler.7 R41.2 U2.8(A7)
Hd_2(3.3): U2.12(Y7) U5.7(IO_L21P_7)  [also labelled L_IO6]
Hd_3: Dribbler.8 R42.2 U2.9(A8)
Hd_3(3.3): U2.11(Y8) U5.6(IO_L20N_7)  [also labelled L_IO5]
INIT_B: R32.2 U5.58(IO_L31N_4/INIT_B) U27.8(OE/~{RESET})
kicker_ready(3.3): U3.14(Y5) U5.105(IO_L20N_2)  [also labelled R_IO3]
L_IO1: R30.1 U5.1(IO_L01P_7/VRN_7)
L_IO2: R36.1 U5.2(IO_L01N_7/VRP_7)
L_IO3: R38.1 U5.4(IO/VREF_7)
L_IO4: R39.1 U5.5(IO_L20P_7)
L_IO11: R2.2 U5.13(IO_L23N_7)
L_IO12: R5.2 U5.14(IO_L24P_7)
L_IO13: R7.2 U5.15(IO_L24N_7)
L_IO14: R9.2 U5.17(IO_L40P_7)
L_IO15: R4.2 U5.18(IO_L40N_7/VREF_7)
L_IO16: R6.2 U5.20(IO_L40P_6/VREF_6)
L_IO17: R8.2 U5.21(IO_L40N_6)
L_IO18: R10.2 U5.23(IO_L24P_6)
L_IO26: R11.2 U5.32(IO_L20P_6)
L_IO27: R13.2 U5.33(IO_L20N_6)
L_IO28: R15.2 U5.35(IO_L01P_6/VRN_6)
L_IO29: R17.2 U5.36(IO_L01N_6/VRP_6)
M1_1: R12.2 R53.1 U13.2(INA)
M1_2: R14.2 R63.1 U13.4(INB)
M1_3: R16.2 R76.1 U11.2(INA)
M1_4: R18.2 R94.1 U11.4(INB)
M1_5: R19.2 R99.1 U9.2(INA)
M1_6: R23.2 R104.1 U9.4(INB)
M2_1: R6.1 R54.1 U18.2(INA)
M2_2: R4.1 R64.1 U18.4(INB)
M2_3: R9.1 R81.1 U16.2(INA)
M2_4: R7.1 R95.1 U16.4(INB)
M2_5: R5.1 R100.1 U6.2(INA)
M2_6: R2.1 R105.1 U6.4(INB)
M3_1: R13.1 R56.1 U14.2(INA)
M3_2: R11.1 R69.1 U14.4(INB)
M3_3: R10.1 R82.1 U12.2(INA)
M3_4: R8.1 R96.1 U12.4(INB)
M3_5: R17.1 R101.1 U20.2(INA)
M3_6: R15.1 R106.1 U20.4(INB)
M4_1: R26.2 R57.1 U19.2(INA)
M4_2: R28.2 R70.1 U19.4(INB)
M4_3: R20.2 R87.1 U17.2(INA)
M4_4: R25.2 R97.1 U17.4(INB)
M4_5: R27.2 R102.1 U15.2(INA)
M4_6: R29.2 R107.1 U15.4(INB)
Md_1: R39.2 R58.1 U7.2(INA)
Md_2: R38.2 R75.1 U7.4(INB)
Md_3: R36.2 R88.1 U8.2(INA)
Md_4: R30.2 R98.1 U8.4(INB)
Md_5: R35.2 R103.1 U10.2(INA)
Md_6: R37.2 R108.1 U10.4(INB)
O11: MOTOR_1.3 Q8.5(D) Q8.6(D) Q8.7(D) Q8.8(D) Q10.5(D) Q10.6(D) Q10.7(D) Q10.8(D)
O12: MOTOR_1.2 Q12.5(D) Q12.6(D) Q12.7(D) Q12.8(D) Q14.5(D) Q14.6(D) Q14.7(D) Q14.8(D)
O13: MOTOR_1.1 Q16.5(D) Q16.6(D) Q16.7(D) Q16.8(D) Q18.5(D) Q18.6(D) Q18.7(D) Q18.8(D)
O21: MOTOR_2.3 Q7.5(D) Q7.6(D) Q7.7(D) Q7.8(D) Q9.5(D) Q9.6(D) Q9.7(D) Q9.8(D)
O22: MOTOR_2.2 Q11.5(D) Q11.6(D) Q11.7(D) Q11.8(D) Q13.5(D) Q13.6(D) Q13.7(D) Q13.8(D)
O23: MOTOR_2.1 Q15.5(D) Q15.6(D) Q15.7(D) Q15.8(D) Q17.5(D) Q17.6(D) Q17.7(D) Q17.8(D)
O31: MOTOR_3.3 Q19.5(D) Q19.6(D) Q19.7(D) Q19.8(D) Q21.5(D) Q21.6(D) Q21.7(D) Q21.8(D)
O32: MOTOR_3.2 Q23.5(D) Q23.6(D) Q23.7(D) Q23.8(D) Q25.5(D) Q25.6(D) Q25.7(D) Q25.8(D)
O33: MOTOR_3.1 Q27.5(D) Q27.6(D) Q27.7(D) Q27.8(D) Q29.5(D) Q29.6(D) Q29.7(D) Q29.8(D)
O41: MOTOR_4.3 Q20.5(D) Q20.6(D) Q20.7(D) Q20.8(D) Q22.5(D) Q22.6(D) Q22.7(D) Q22.8(D)
O42: MOTOR_4.2 Q24.5(D) Q24.6(D) Q24.7(D) Q24.8(D) Q26.5(D) Q26.6(D) Q26.7(D) Q26.8(D)
O43: MOTOR_4.1 Q28.5(D) Q28.6(D) Q28.7(D) Q28.8(D) Q30.5(D) Q30.6(D) Q30.7(D) Q30.8(D)
Od1: Dribbler.3 Q1.5(D) Q1.6(D) Q1.7(D) Q1.8(D) Q2.5(D) Q2.6(D) Q2.7(D) Q2.8(D)
Od2: Dribbler.2 Q3.5(D) Q3.6(D) Q3.7(D) Q3.8(D) Q4.5(D) Q4.6(D) Q4.7(D) Q4.8(D)
Od3: Dribbler.1 Q5.5(D) Q5.6(D) Q5.7(D) Q5.8(D) Q6.5(D) Q6.6(D) Q6.7(D) Q6.8(D)
Over_Drib(3.3): U2.17(Y2)
P.R TDO: R341.1 U27.17(TDO)
PROG_B: R33.1 U5.143(PROG_B) U27.7(~{CF})
R_IO1: Gyro_&_Accel.3 Gyro_&_Accel.6 R149.2 U5.108(IO_L01N_2/VRP_2)  [also labelled SDA]
R_IO2: Gyro_&_Accel.4 Gyro_&_Accel.7 R150.2 U5.107(IO_L01P_2/VRN_2)  [also labelled SCL]
R_IO7: R12.1 U5.100(IO_L22N_2)
R_IO8: R14.1 U5.99(IO_L22P_2)
R_IO9: R16.1 U5.98(IO_L23N_2/VREF_2)
R_IO10: R18.1 U5.97(IO_L23P_2)
R_IO11: R19.1 U5.96(IO_L24N_2)
R_IO12: R23.1 U5.95(IO_L24P_2)
R_IO13: R26.1 U5.93(IO_L40N_2)
R_IO14: R28.1 U5.92(IO_L40P_2/VREF_2)
R_IO22: R20.1 U5.82(IO_L22P_3)
R_IO23: R25.1 U5.80(IO_L21N_3)
R_IO24: R27.1 U5.79(IO_L21P_3)
R_IO25: R29.1 U5.78(IO_L20N_3)
R_IO26: R120.1 S2D3.2(A1) U5.77(IO_L20P_3)
R_IO27: R121.1 S2D3.3(A2) U5.76(IO)
R_IO28: R123.1 S2D3.4(A3) U5.74(IO_L01N_3/VRP_3)
R_IO29: R124.1 S2D3.5(A4) U5.73(IO_L01P_3/VRN_3)
S_TDO: P13.4 U5.109(TDO)
Servo_O: P1.1 S2D3.18(Y1)
Shoot_pulse: Booster.1 R116.2 U5.118(IO_L28P_1)  [also labelled U_IO11]
TCK: P13.3 R342.1 U27.6(TCK)
TDI: P13.5 U27.4(TDI)
TMS: P13.6 R343.1 U27.5(TMS)
U_IO1: R35.1 U5.141(IO_L01N_0/VRP_0)
U_IO2: R37.1 U5.140(IO_L01P_0/VRN_0)
U_IO3: Gyro_&_Accel.11 R160.2 U5.137(IO_L27N_0)
U_IO4: Gyro_&_Accel.10 R159.1 U5.135(IO_L27P_0)
U_IO5: R113.1 S_D_1.2 U5.127(IO_L32P_0/GCLK6)
U_IO6: R133.1 S_D_2.2 U5.125(IO_L32N_1/GCLK5)
U_IO7: R153.1 S_D_3.2 U5.124(IO_L32P_1/GCLK4)
U_IO8: R173.1 S_D_4.2 U5.123(IO_L31N_1/VREF_1)
U_IO9: C64.2 P2.2 R55.1 R93.2 U5.122(IO_L31P_1)
U_IO10: R333.2 U5.119(IO_L28N_1)
U_IO14: Gyro_&_Accel.8 R155.1 U5.112(IO_L01P_1/VRN_1)
NetAntenna_3: Antenna.3 telecontrolli.5
NetBattery_2: Battery.2 P16.5 P16.6 R_D_REV.1
NetBuzzer_4: Buzzer.4 Q_BUZZ.3(C)
NetC_ADC_2: C_ADC.2 R46.1 U21.5(D)
NetD1_2: D1.2(K) R1.1
NetD3_2: D3.2(K) R3.2
NetD21_2: D21.2(K) R21.2
NetD24_2: D24.2(K) R24.2
NetD_D_1_2: D_D_1.2(K) R114.1
NetD_D_2_2: D_D_2.2(K) R134.1
NetD_D_3_2: D_D_3.2(K) R154.1
NetD_D_4_2: D_D_4.2(K) R174.1
NetD_Done_2: D_Done.2(K) R_done_led.1
NetD_REV_2: D_REV.2(K) R_D_REV.2
Nete1_2: e1.2 U4.2(A1)
Nete1_3: e1.3 U4.3(A2)
Nete2_2: e2.2 U1.7(A6)
Nete2_3: e2.3 U1.8(A7)
Nete3_2: e3.2 U1.5(A4)
Nete3_3: e3.3 U1.6(A5)
Nete4_2: e4.2 U4.5(A4)
Nete4_3: e4.3 U4.6(A5)
NetP2_3: P2.3 U22.7(OUTA)
NetP2_4: P2.4 R44.1
NetQ1_4: Q1.4(G) R47.2 R129.2
NetQ2_4: Q2.4(G) R48.2
NetQ3_4: Q3.4(G) R49.2 R130.2
NetQ4_4: Q4.4(G) R50.2
NetQ5_4: Q5.4(G) R51.2 R135.2
NetQ6_4: Q6.4(G) R52.2
NetQ7_4: Q7.4(G) R59.2 R136.2
NetQ8_4: Q8.4(G) R60.2 R137.2
NetQ9_4: Q9.4(G) R61.2
NetQ10_4: Q10.4(G) R62.2
NetQ11_4: Q11.4(G) R65.2 R138.2
NetQ12_4: Q12.4(G) R66.2 R139.2
NetQ13_4: Q13.4(G) R67.2
NetQ14_4: Q14.4(G) R68.2
NetQ15_4: Q15.4(G) R71.2 R140.2
NetQ16_4: Q16.4(G) R72.2 R141.2
NetQ17_4: Q17.4(G) R73.2
NetQ18_4: Q18.4(G) R74.2
NetQ19_4: Q19.4(G) R77.2 R142.2
NetQ20_4: Q20.4(G) R78.2 R143.2
NetQ21_4: Q21.4(G) R79.2
NetQ22_4: Q22.4(G) R80.2
NetQ23_4: Q23.4(G) R83.2 R144.2
NetQ24_4: Q24.4(G) R84.2 R145.2
NetQ25_4: Q25.4(G) R85.2
NetQ26_4: Q26.4(G) R86.2
NetQ27_4: Q27.4(G) R89.2 R146.2
NetQ28_4: Q28.4(G) R90.2 R147.2
NetQ29_4: Q29.4(G) R91.2
NetQ30_4: Q30.4(G) R92.2
NetQ_BUZZ_1: Q_BUZZ.1(B) R_Buzz.2
NetR22_1: R22.1 U22.4(INB)
NetR31_2: R31.2 R345.2 R346.2
NetR43_1: R43.1 R45.2 U21.1(~{S})
NetR46_2: R46.2 U21.3(~{W})
NetR47_1: R47.1 U7.7(OUTA)
NetR48_1: R48.1 U7.5(OUTB)
NetR49_1: R49.1 U8.7(OUTA)
NetR50_1: R50.1 U8.5(OUTB)
NetR51_1: R51.1 U10.7(OUTA)
NetR52_1: R52.1 U10.5(OUTB)
NetR59_1: R59.1 U6.7(OUTA)
NetR60_1: R60.1 U9.7(OUTA)
NetR61_1: R61.1 U6.5(OUTB)
NetR62_1: R62.1 U9.5(OUTB)
NetR65_1: R65.1 U16.7(OUTA)
NetR66_1: R66.1 U11.7(OUTA)
NetR67_1: R67.1 U16.5(OUTB)
NetR68_1: R68.1 U11.5(OUTB)
NetR71_1: R71.1 U18.7(OUTA)
NetR72_1: R72.1 U13.7(OUTA)
NetR73_1: R73.1 U18.5(OUTB)
NetR74_1: R74.1 U13.5(OUTB)
NetR77_1: R77.1 U12.7(OUTA)
NetR78_1: R78.1 U15.7(OUTA)
NetR79_1: R79.1 U12.5(OUTB)
NetR80_1: R80.1 U15.5(OUTB)
NetR83_1: R83.1 U14.7(OUTA)
NetR84_1: R84.1 U17.7(OUTA)
NetR85_1: R85.1 U14.5(OUTB)
NetR86_1: R86.1 U17.5(OUTB)
NetR89_1: R89.1 U20.7(OUTA)
NetR90_1: R90.1 U19.7(OUTA)
NetR91_1: R91.1 U20.5(OUTB)
NetR92_1: R92.1 U19.5(OUTB)
NetR112_1: R112.1 R148.1 S_SET.8
NetR122_2: R122.2 S4.1
NetR333_1: R333.1 U22.2(INA)
NetR341_2: R341.2 U5.144(TDI)
NetR342_2: R342.2 U5.110(TCK)
NetR343_2: R343.2 U5.111(TMS)

Not connected (* = marked no-connect by the designer): Buzzer 2 3; Gyro_&_Accel 2; MinMax 1 2 7 8 9 10 11 12 13 14 15 16 18 19 20 22 23 24; S2D3 11(Y8); telecontrolli 7 8; U1 11(Y8); U2 18(Y1); U3 11(Y8) 12(Y7) 13(Y6) 18(Y1); U4 16(Y3); U5 142(HSWAP_EN); U6 1(NC) 8(NC); U7 1(NC) 8(NC); U8 1(NC) 8(NC); U9 1(NC) 8(NC); U10 1(NC) 8(NC); U11 1(NC) 8(NC); U12 1(NC) 8(NC); U13 1(NC) 8(NC); U14 1(NC) 8(NC); U15 1(NC) 8(NC); U16 1(NC) 8(NC); U17 1(NC) 8(NC); U18 1(NC) 8(NC); U19 1(NC) 8(NC); U20 1(NC) 8(NC); U22 1(NC) 5(OUTB) 8(NC); U27 2(DNC) 9(DNC) 12(DNC) 13(~{CEO}) 14(DNC) 15(DNC) 16(DNC); X1 1(E/D)

## Notes on the sheet
- Yek adad Res 82 be output e regulator e 2.5 vasl shavad
- Labels drawn without touching a wire or pin: Over_Drib
- (in symbol IRF7201) 5, 6, 7, 8; 1, 2, 3
- (in symbol IRF7204) 1, 2, 3; 5, 6, 7, 8
- (in symbol MAX4427CSA) A; B
- (in symbol XC3S400-5TQ144C, part A) BANK 0
- (in symbol XC3S400-5TQ144C, part B) BANK 1
- (in symbol XC3S400-5TQ144C, part C) BANK 2
- (in symbol XC3S400-5TQ144C, part D) BANK 3
- (in symbol XC3S400-5TQ144C, part E) BANK 4
- (in symbol XC3S400-5TQ144C, part F) BANK 5
- (in symbol XC3S400-5TQ144C, part G) BANK 6
- (in symbol XC3S400-5TQ144C, part H) BANK 7

## Library data of the parts
Antenna Booster = Header 5: Header, 5-Pin; LatestRevisionDate: 17-Jul-2002; LatestRevisionNote: Re-released for DXP Platform.; Publisher: Altium Limited
Battery = Header 2: Header, 2-Pin; LatestRevisionDate: 17-Jul-2002; LatestRevisionNote: Re-released for DXP Platform.; Publisher: Altium Limited
Buzzer e1-e4 P2 = Header 4: Header, 4-Pin; LatestRevisionDate: 17-Jul-2002; LatestRevisionNote: Re-released for DXP Platform.; Publisher: Altium Limited
C1-C3 C5-C7 C9 C10 C20 C63 C65-C72 C81 C110 C120 C130 C_ADC C_IR = CAP: Capacitor; Fitted: True
C2(tele) C(tele) RST_CAP_1 = Cap: Capacitor; Published: 8-Jun-2000; LatestRevisionDate: 17-Jul-2002; LatestRevisionNote: Re-released for DXP Platform.; PackageReference: RAD-0.3; Publisher: Altium Limited
  C2(tele) C(tele): Value: 100nF
  RST_CAP_1: Value: 1uF
C4 C_DRIBBLER C_M1-C_M4 C_MIKONA = Cap Pol1: Polarized Capacitor (Radial); Published: 8-Jun-2000; LatestRevisionDate: 17-Jul-2002; LatestRevisionNote: Re-released for DXP Platform.; PackageReference: RB7.6-15; Publisher: Altium Limited; Value: 680uF
C8 C11-C19 C22-C62 C64 C73-C79 CnRF = Cap Semi: Capacitor (Semiconductor SIM Model); Published: 8-Jun-2000; LatestRevisionDate: 17-Jul-2002; LatestRevisionNote: Re-released for DXP Platform.; PackageReference: C1206; Publisher: Altium Limited
  C8 C12 C16-C19 C26 C28 C30 C34 C37-C40 C42 C44 C46 C48 C50 C52 C54 C56 C58 C60 C64 C76 CnRF: Value: 100nF
  C11 C14 C22 C23 C27 C29 C32 C36 C41 C43 C45 C47 C49 C51 C53 C55 C57 C59 C61: Value: 1uF
  C13 C15 C24 C25 C33 C35 C73-C75 C77-C79: Value: 10nF
  C31 C62: Value: 10uF
C21 = C_Dup1
C80 C_1 C_16 C_17 C_19 = Cap Pol3: Polarized Capacitor (Surface Mount); Published: 8-Jun-2000; LatestRevisionDate: 17-Jul-2002; LatestRevisionNote: Re-released for DXP Platform.; PackageReference: C0805; Publisher: Altium Limited; Value: 100uF
D1 D3 D21 D24 D_D_1-D_D_4 D_Done D_REV = LED2: Typical RED, GREEN, YELLOW, AMBER GaAs LED; Published: 8-Jun-2000; LatestRevisionDate: 17-Jul-2002; LatestRevisionNote: Re-released for DXP Platform.; PackageDocument: Feb-2002; PackageReference: 3.2X1.6X1.1; Publisher: Altium Limited
D_correction = Diode 1N4001: 1 Amp General Purpose Rectifier; Published: 8-Jun-2000; LatestRevisionDate: 17-Jul-2002; LatestRevisionNote: Re-released for DXP Platform.; DatasheetDocument: 1998; PackageDocument: Aug-1999; PackageReference: DO-41; Publisher: Altium Limited; Code_JEDEC: DO-204-AL; ComponentLink1Description: Manufacturer Link; ComponentLink1URL: http://www.fairchildsemi.com/; ComponentLink2Description: Datasheet; ComponentLink2URL: http://www.fairchildsemi.com/ds/1N%2F1N4001.pdf
Dribbler MOTOR_1-MOTOR_4 nRF = Header 8: Header, 8-Pin; LatestRevisionDate: 17-Jul-2002; LatestRevisionNote: Re-released for DXP Platform.; Publisher: Altium Limited
Gyro_&_Accel = Header 8X2: Header, 8-Pin, Dual row; LatestRevisionDate: 17-Jul-2002; LatestRevisionNote: Re-released for DXP Platform.; Publisher: Altium Limited
MinMax = Header 12X2: Header, 12-Pin, Dual row; LatestRevisionDate: 17-Jul-2002; LatestRevisionNote: Re-released for DXP Platform.; Publisher: Altium Limited
P1 = Header 3: Header, 3-Pin; LatestRevisionDate: 17-Jul-2002; LatestRevisionNote: Re-released for DXP Platform.; Publisher: Altium Limited
P13 = Header 6: Header, 6-Pin; LatestRevisionDate: 17-Jul-2002; LatestRevisionNote: Re-released for DXP Platform.; Publisher: Altium Limited
P16 = Header 3X2: Header, 3-Pin, Dual row; LatestRevisionDate: 17-Jul-2002; LatestRevisionNote: Re-released for DXP Platform.; Publisher: Altium Limited
Q1 Q3 Q5 Q7 Q8 Q11 Q12 Q15 Q16 Q19 Q20 Q23 Q24 Q27 Q28 = IRF7204: HEXFET Power MOSFET; Published: 8-Jun-2000; LatestRevisionDate: 13-Apr-2006; LatestRevisionNote: IPC-7351 Footprint Added.; DatasheetVersion: Aug-1997; PackageVersion: Feb-2001; PackageReference: SO-8; Publisher: Altium Limited; PackageDescription: 8-Pin Plastic Small Outline Integrated Circuit 1.27 mm Pitch; Code_JEDEC: MS-012-AA; Code_IPC: SOIC127P600-8; ComponentLink1Description: Manufacturer Link; ComponentLink1URL: http://www.irf.com/; ComponentLink2Description: Datasheet; ComponentLink2URL: http://www.irf.com/product-info/datasheets/data/irf7204.pdf
Q2 Q4 Q6 Q9 Q10 Q13 Q14 Q17 Q18 Q21 Q22 Q25 Q26 Q29 Q30 = IRF7201: HEXFET Power MOSFET; Published: 8-Jun-2000; LatestRevisionDate: 13-Apr-2006; LatestRevisionNote: IPC-7351 Footprint Added.; DatasheetVersion: Sep-1998; PackageVersion: Feb-2001; PackageReference: SO-8; Publisher: Altium Limited; PackageDescription: 8-Pin Plastic Small Outline Integrated Circuit 1.27 mm Pitch; Code_JEDEC: MS-012-AA; Code_IPC: SOIC127P600-8; ComponentLink1Description: Manufacturer Link; ComponentLink1URL: http://www.irf.com/; ComponentLink2Description: Datasheet; ComponentLink2URL: http://www.irf.com/product-info/datasheets/data/irf7201.pdf
Q_BUZZ = PMBTA14: NPN Darlington Transistor; Published: 17-Sep-2003; LatestRevisionDate: 12-Dec-2006; LatestRevisionNote: IPC-7351 Footprint Added.; DatasheetVersion: 29-Apr-1999; PackageVersion: May-1999; PackageReference: SOT23; Publisher: Altium Limited; PackageDescription: 3-Pin SOT-23 Package 0.95 mm Pitch, 2.3 mm Lead Span; ComponentLink1Description: Manufacturer Link; ComponentLink1URL: http://www.semiconductors.philips.com/; ComponentLink2Description: Datasheet; ComponentLink2URL: http://www.semiconductors.philips.com/acrobat/datasheets/PMBTA13_PMBTA14_5.pdf
R1 R3 R21 R24 R43 R45 R_D_REV = Res2: Resistor; Published: 8-Jun-2000; LatestRevisionDate: 17-Jul-2002; LatestRevisionNote: Re-released for DXP Platform.; PackageReference: AXIAL-0.4; Publisher: Altium Limited
  R1 R3 R21 R24 R_D_REV: Value: 1K
  R43: Value: 27K
  R45: Value: 3.6K
R2 R2.5 R4-R20 R22 R23 R25-R42 R44 R46-R121 R123-R160 R171-R174 R333 R341-R343 R345 R346 R_Buzz R_done_led = Res Semi: Semiconductor Resistor; Published: 8-Jun-2000; LatestRevisionDate: 17-Jul-2002; LatestRevisionNote: Re-released for DXP Platform.; PackageReference: AXIAL-0.5; Publisher: Altium Limited
  R2 R4-R20 R22 R23 R25-R30 R35-R39 R333: Value: 200
  R2.5: Value: 82
  R31 R345 R346 R_Buzz: Value: 100
  R32 R33: Value: 4.7K
  R34: Value: 330
  R40-R42 R93 R111-R114 R119 R131-R134 R148-R155 R159 R160 R171-R174 R_done_led: Value: 1K
  R44 R55: Value: 2.2K
  R46: Value: 390
  R47-R52 R59-R62 R65-R68 R71-R74 R77-R80 R83-R86 R89-R92: Value: 50
  R53 R54 R56-R58 R63 R64 R69 R70 R75 R76 R81 R82 R87 R88 R94-R110 R115-R118 R120 R121 R123-R128 R156-R158: Value: 10K
  R129 R130 R135-R147: Value: 5.6K
  R341-R343: Value: 68
R122 R(rst) = Res1: Resistor; Published: 8-Jun-2000; LatestRevisionDate: 17-Jul-2002; LatestRevisionNote: Re-released for DXP Platform.; PackageReference: AXIAL-0.3; Publisher: Altium Limited
  R122: Value: 100
  R(rst): Value: 1K
S2D3 U1-U4 = SN74HC541DW: Octal Buffer/Driver with 3-State Outputs; Published: 8-Jun-2000; LatestRevisionDate: 13-Apr-2006; LatestRevisionNote: IPC-7351 Footprint Added.; DatasheetVersion: May-1997; PackageVersion: Mar-2000; PackageReference: DW020; Publisher: Altium Limited; PackageDescription: 20-Pin Plastic Small Outline Integrated Circuit 1.27 mm Pitch; Code_JEDEC: MS-013; Code_IPC: SOIC127P1030-20; ComponentLink1Description: Manufacturer Link; ComponentLink1URL: http://www.ti.com/; ComponentLink2Description: Datasheet; ComponentLink2URL: http://www-s.ti.com/sc/ds/sn74hc541.pdf
S4 S_D_1-S_D_4 = SW-PB: Switch; Published: 24-Mar-1999; LatestRevisionDate: 17-Jul-2002; LatestRevisionNote: Re-released for DXP Platform.; PackageReference: SPST-2; Publisher: Altium Limited
S_ID S_SET = SW-DIP4: DIP Switch; Published: 24-Mar-1999; LatestRevisionDate: 17-Jul-2002; LatestRevisionNote: Re-released for DXP Platform.; PackageReference: DIP-8; Publisher: Altium Limited
telecontrolli = Header 8X2A: Header, 8-Pin, Dual row; LatestRevisionDate: 17-Jul-2002; LatestRevisionNote: Re-released for DXP Platform.; Publisher: Altium Limited
U5 = XC3S400-5TQ144C: Spartan-3 1.2V FPGA, 97 User I/Os, 144-Pin TQFP, High Performance, Commercial Grade; Ordering Information: Additional code may have to be appended for different mask revision devices.; Published: 17-Sep-2003; LatestRevisionDate: 13-Apr-2006; LatestRevisionNote: IPC-7351 Footprint Added.; DatasheetVersion: ver2.3, Nov-2007; PackageVersion: ver1.2, Jun-2004; PackageReference: TQ144; Publisher: Altium Limited; PackageDescription: 144-Pin Thin Quad Flat Pack (TQ144); Code_JEDEC: MS-026-BFB; ComponentLink1Description: Manufacturer Link; ComponentLink1URL: http://www.xilinx.com/products/silicon_solutions/fpgas/spartan_series/spartan3_fpgas/index.htm; ComponentLink2Description: Datasheet; ComponentLink2URL: http://direct.xilinx.com/bvdocs/publications/ds099.pdf
U6-U20 U22 = MAX4427CSA: Dual High-Speed 1.5A MOSFET Driver; Published: 16-Jan-2001; LatestRevisionDate: 13-Apr-2006; LatestRevisionNote: IPC-7351 Footprint Added.; DatasheetVersion: Mar-1993; PackageReference: NSO8; Publisher: Altium Limited; PackageDescription: 8-Pin Small Outline Integrated Circuit 1.27 mm Pitch; Code_JEDEC: MS-012-AA; Code_IPC: SOIC127P600-8; ComponentLink1Description: Manufacturer Link; ComponentLink1URL: http://www.maxim-ic.com/; ComponentLink2Description: Datasheet; ComponentLink2URL: http://pdfserv.maxim-ic.com/en/ds/MAX4426-MAX4428.pdf
U21 U36 = M25P10-VMN6: 8 Mbit Flash Serial Prom; Fitted: True
U27 = XCF04SVO20C: XCF00S Series, Platform Flash In-System Programmable Configuration 3.3V PROM, 20-Pin TSOP, 4-Megabit, Commercial Grade; Published: 17-Sep-2003; LatestRevisionDate: 04-Mar-2005; LatestRevisionNote: Stylized 3D Model Added.; DatasheetVersion: ver2.9, May-2006; PackageVersion: ver1.2.1, Apr-2005; PackageReference: VO20; Publisher: Altium Limited; PackageDescription: 20-Pin Thin Shrink Small Outline Package (VO20); Code_JEDEC: MO-153-AC; ComponentLink1Description: Manufacturer Link; ComponentLink1URL: http://www.xilinx.com/products/design_resources/config_sol/index.htm; ComponentLink2Description: Datasheet; ComponentLink2URL: http://direct.xilinx.com/bvdocs/publications/ds123.pdf
VR_1.2 = LF12ABDT: 500mA, Very Low Drop (0.45V) Voltage Regulator; Published: 24-Aug-2001; LatestRevisionDate: 06-Jun-2005; LatestRevisionNote: PCB pads lengthened.; DatasheetVersion: Feb-2004; PackageVersion: Jun-2004; PackageReference: TO-252; Publisher: Altium Limited; PackageDescription: D-PAK/TO-252-AA; 3 Leads (1 Cropped); Body 10.1 (inc. leads) x 6.6 mm (LxW max); ComponentLink1Description: Manufacturer Link; ComponentLink1URL: http://www.st.com/; ComponentLink2Description: Datasheet; ComponentLink2URL: http://www.st.com/stonline/books/pdf/docs/2574.pdf
VR_2.5 = LF25ABDT: 500mA, Very Low Drop (0.45V) Voltage Regulator; Published: 24-Aug-2001; LatestRevisionDate: 06-Jun-2005; LatestRevisionNote: PCB pads lengthened.; DatasheetVersion: Feb-2004; PackageVersion: Jun-2004; PackageReference: TO-252; Publisher: Altium Limited; PackageDescription: D-PAK/TO-252-AA; 3 Leads (1 Cropped); Body 10.1 (inc. leads) x 6.6 mm (LxW max); ComponentLink1Description: Manufacturer Link; ComponentLink1URL: http://www.st.com/; ComponentLink2Description: Datasheet; ComponentLink2URL: http://www.st.com/stonline/books/pdf/docs/2574.pdf
VR_3.3 = LT1585ACM-1.5: 5A Low Dropout Fast Response Positive Fixed Voltage Regulator; Published: 15-Apr-2002; DatasheetVersion: 1999; PackageVersion: 1997; PackageReference: 936-03; Publisher: Altium Limited; PackageDescription: D2-PAK/TO-263-AB; 3 Leads (1 Cropped); Body 14.7 (inc. leads) x 10.2 mm (LxW max); ComponentLink1Description: Manufacturer Link; ComponentLink1URL: http://www.onsemi.com/site/products/taxonomy/0,4438,503,00.html
X1 = QSMO_4200: QSMO - 4200 SERIES, 40MHz, SURFACE MOUNT CRYSTAL OSCILLATOR; Published: 5-Jan-2004; DatasheetDocument: 15-Jul-02; Publisher: Altium Limited